# Altium project PiMX8MP_r0.3_release.PrjPcb (part 2 of 6)

## Sheet 06_8MPLUS_IO.SchDoc: 8MPLUS_IO
size 420 x 297 mm; Author: Lukas Henkel; DocumentNumber: 6; SheetNumber: 6; SheetTotal: 16; DocSize: A3
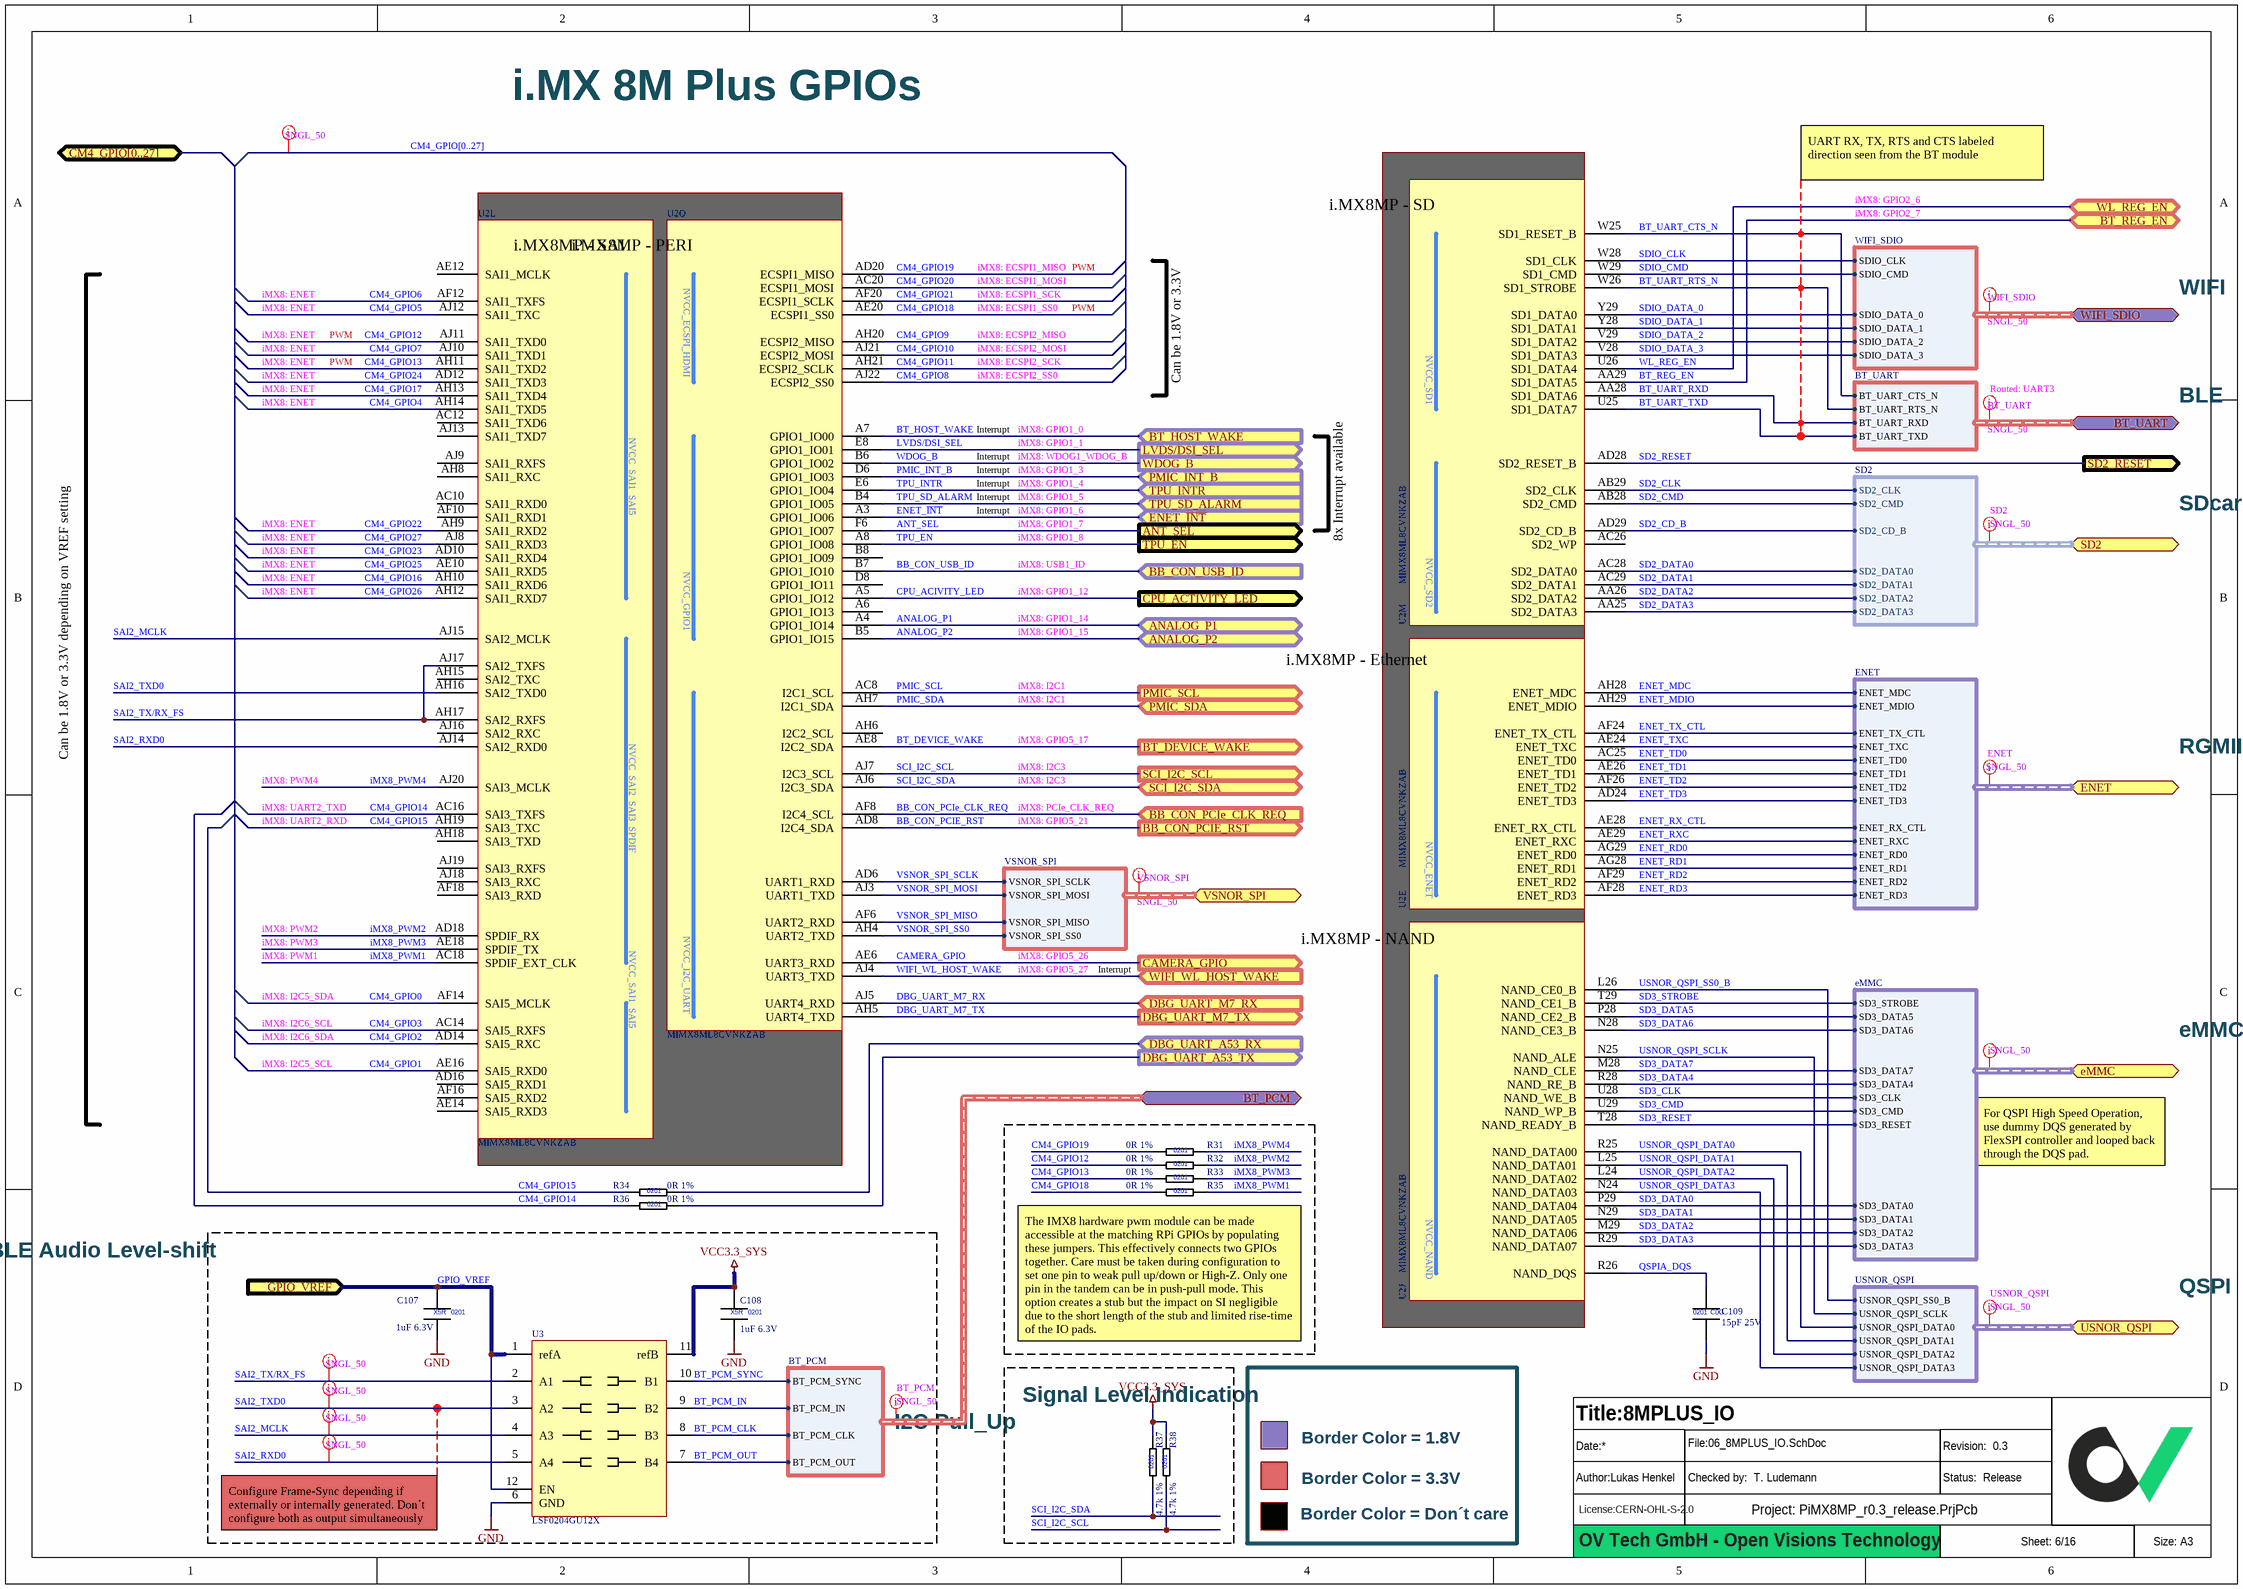
[diagram p6: 06_8MPLUS_IO.SchDoc]

### Parts
(Parts that share a designator on the sheet are numbered #1, #2 ... from top to bottom, then left to right.)
?#6  (no value)  (graphical)
C107  1uF 6.3V  [CAPC0603X03L]
C108  1uF 6.3V  [CAPC0603X03L]
C109  15pF 25V  [CAPC0603X03L]
R31  0R 1%  [RESC0603X03L]
R32  0R 1%  [RESC0603X03L]
R33  0R 1%  [RESC0603X03L]
R34  0R 1%  [RESC0603X03L]
R35  0R 1%  [RESC0603X03L]
R36  0R 1%  [RESC0603X03L]
R37  4.7k 1%  [RESC0603X03L]
R38  4.7k 1%  [RESC0603X03L]
U2  MIMX8ML8CVNKZAB  [BGA548C50P29X29_1500X1500X148]  (parts E,J,L,M,O of 15)
U3  LSF0204GU12X  [QFN40P170X200X50-12L]

### Blocks framed on the sheet
BLE Audio Level-shift: C107 C108 U3
I2C Pull_Up: R37 R38

### Ports
ANALOG_P1 (bidir), ANALOG_P2 (bidir), ANT_SEL (out), BB_CON_PCIe_CLK_REQ (in), BB_CON_PCIE_RST (out), BB_CON_USB_ID (in), BT_DEVICE_WAKE (out), BT_HOST_WAKE (in), BT_PCM (bidir, harness BT_PCM), BT_REG_EN (bidir), BT_UART (bidir, harness BT_UART), CAMERA_GPIO (out), CM4_GPIO[0..27] (bidir), CPU_ACTIVITY_LED (out), DBG_UART_A53_RX (in), DBG_UART_A53_TX (out), DBG_UART_M7_RX (in), DBG_UART_M7_TX (out), eMMC (bidir, harness eMMC), ENET (bidir, harness ENET), ENET_~{INT} (in), GPIO_VREF (in), LVDS/DSI_SEL (out), PMIC_INT_B (in), PMIC_SCL (out), PMIC_SDA (bidir), SCI_I2C_SCL (out), SCI_I2C_SDA (bidir), SD2 (bidir, harness SD2), SD2_RESET (out), TPU_EN (out), TPU_INTR (in), TPU_SD_ALARM (in), USNOR_QSPI (bidir, harness USNOR_QSPI), VSNOR_SPI (bidir, harness VSNOR_SPI), WDOG_B (out), WIFI_SDIO (bidir, harness WIFI_SDIO), WIFI_WL_HOST_WAKE (in), WL_REG_EN (bidir)

### Harnesses
ENET: ENET_MDC, ENET_MDIO, ENET_TX_CTL, ENET_TXC, ENET_TD0, ENET_TD1, ENET_TD2, ENET_TD3, ENET_RX_CTL, ENET_RXC, ENET_RD0, ENET_RD1, ENET_RD2, ENET_RD3
SD2: SD2_CLK, SD2_CMD, SD2_CD_B, SD2_DATA0, SD2_DATA1, SD2_DATA2, SD2_DATA3
WIFI_SDIO: SDIO_DATA_1, SDIO_DATA_0, SDIO_DATA_3, SDIO_DATA_2, SDIO_CMD, SDIO_CLK
BT_UART: BT_UART_TXD, BT_UART_RXD, BT_UART_RTS_N, BT_UART_CTS_N
BT_PCM: BT_PCM_SYNC, BT_PCM_IN, BT_PCM_OUT, BT_PCM_CLK
eMMC: SD3_STROBE, SD3_CLK, SD3_CMD, SD3_DATA0, SD3_DATA1, SD3_DATA2, SD3_DATA3, SD3_DATA4, SD3_DATA5, SD3_DATA6, SD3_DATA7, SD3_RESET
USNOR_QSPI: USNOR_QSPI_SCLK, USNOR_QSPI_SS0_B, USNOR_QSPI_DATA0, USNOR_QSPI_DATA1, USNOR_QSPI_DATA2, USNOR_QSPI_DATA3
VSNOR_SPI: VSNOR_SPI_SS0, VSNOR_SPI_SCLK, VSNOR_SPI_MOSI, VSNOR_SPI_MISO

### Nets
GND: C107.2 C108.2 C109.2 U3.6(GND)
VCC3.3_SYS: C108.1 R37.2 R38.2 U3.11(refB)
ANALOG_P1: U2.A4(GPIO1_IO14) ; port ANALOG_P1
ANALOG_P2: U2.B5(GPIO1_IO15) ; port ANALOG_P2
ANT_SEL: U2.F6(GPIO1_IO07) ; port ANT_SEL
BB_CON_PCIe_CLK_REQ: U2.AF8(I2C4_SCL) ; port BB_CON_PCIe_CLK_REQ
BB_CON_PCIE_RST: U2.AD8(I2C4_SDA) ; port BB_CON_PCIE_RST
BB_CON_USB_ID: U2.B7(GPIO1_IO10) ; port BB_CON_USB_ID
BT_DEVICE_WAKE: U2.AE8(I2C2_SDA) ; port BT_DEVICE_WAKE
BT_HOST_WAKE: U2.A7(GPIO1_IO00) ; port BT_HOST_WAKE
BT_PCM_CLK: U3.8(B3) ; port BT_PCM.BT_PCM_CLK
BT_PCM_IN: U3.9(B2) ; port BT_PCM.BT_PCM_IN
BT_PCM_OUT: U3.7(B4) ; port BT_PCM.BT_PCM_OUT
BT_PCM_SYNC: U3.10(B1) ; port BT_PCM.BT_PCM_SYNC
BT_REG_EN: U2.AA29(SD1_DATA5) ; port BT_REG_EN
BT_UART_CTS_N: U2.W25(SD1_RESET_B) ; port BT_UART.BT_UART_CTS_N
BT_UART_RTS_N: U2.W26(SD1_STROBE) ; port BT_UART.BT_UART_RTS_N
BT_UART_RXD: U2.AA28(SD1_DATA6) ; port BT_UART.BT_UART_RXD
BT_UART_TXD: U2.U25(SD1_DATA7) ; port BT_UART.BT_UART_TXD
CAMERA_GPIO: U2.AE6(UART3_RXD) ; port CAMERA_GPIO
CM4_GPIO0: U2.AF14(SAI5_MCLK)
CM4_GPIO1: U2.AE16(SAI5_RXD0)
CM4_GPIO2: U2.AD14(SAI5_RXC)
CM4_GPIO3: U2.AC14(SAI5_RXFS)
CM4_GPIO4: U2.AH14(SAI1_TXD5)
CM4_GPIO5: U2.AJ12(SAI1_TXC)
CM4_GPIO6: U2.AF12(SAI1_TXFS)
CM4_GPIO7: U2.AJ10(SAI1_TXD1)
CM4_GPIO8: U2.AJ22(ECSPI2_SS0)
CM4_GPIO9: U2.AH20(ECSPI2_MISO)
CM4_GPIO10: U2.AJ21(ECSPI2_MOSI)
CM4_GPIO11: U2.AH21(ECSPI2_SCLK)
CM4_GPIO12: R32.1 U2.AJ11(SAI1_TXD0)
CM4_GPIO13: R33.1 U2.AH11(SAI1_TXD2)
CM4_GPIO14: R36.1 U2.AC16(SAI3_TXFS)
CM4_GPIO15: R34.1 U2.AH19(SAI3_TXC)
CM4_GPIO16: U2.AH10(SAI1_RXD6)
CM4_GPIO17: U2.AH13(SAI1_TXD4)
CM4_GPIO18: R35.1 U2.AE20(ECSPI1_SS0)
CM4_GPIO19: R31.1 U2.AD20(ECSPI1_MISO)
CM4_GPIO20: U2.AC20(ECSPI1_MOSI)
CM4_GPIO21: U2.AF20(ECSPI1_SCLK)
CM4_GPIO22: U2.AH9(SAI1_RXD2)
CM4_GPIO23: U2.AD10(SAI1_RXD4)
CM4_GPIO24: U2.AD12(SAI1_TXD3)
CM4_GPIO25: U2.AE10(SAI1_RXD5)
CM4_GPIO26: U2.AH12(SAI1_RXD7)
CM4_GPIO27: U2.AJ8(SAI1_RXD3)
CPU_ACIVITY_LED: U2.A5(GPIO1_IO12) ; port CPU_ACTIVITY_LED
DBG_UART_A53_RX: R34.2 ; port DBG_UART_A53_RX
DBG_UART_A53_TX: R36.2 ; port DBG_UART_A53_TX
DBG_UART_M7_RX: U2.AJ5(UART4_RXD) ; port DBG_UART_M7_RX
DBG_UART_M7_TX: U2.AH5(UART4_TXD) ; port DBG_UART_M7_TX
ENET_~{INT}: U2.A3(GPIO1_IO06) ; port ENET_~{INT}
ENET_MDC: U2.AH28(ENET_MDC) ; port ENET.ENET_MDC
ENET_MDIO: U2.AH29(ENET_MDIO) ; port ENET.ENET_MDIO
ENET_RD0: U2.AG29(ENET_RD0) ; port ENET.ENET_RD0
ENET_RD1: U2.AG28(ENET_RD1) ; port ENET.ENET_RD1
ENET_RD2: U2.AF29(ENET_RD2) ; port ENET.ENET_RD2
ENET_RD3: U2.AF28(ENET_RD3) ; port ENET.ENET_RD3
ENET_RX_CTL: U2.AE28(ENET_RX_CTL) ; port ENET.ENET_RX_CTL
ENET_RXC: U2.AE29(ENET_RXC) ; port ENET.ENET_RXC
ENET_TD0: U2.AC25(ENET_TD0) ; port ENET.ENET_TD0
ENET_TD1: U2.AE26(ENET_TD1) ; port ENET.ENET_TD1
ENET_TD2: U2.AF26(ENET_TD2) ; port ENET.ENET_TD2
ENET_TD3: U2.AD24(ENET_TD3) ; port ENET.ENET_TD3
ENET_TX_CTL: U2.AF24(ENET_TX_CTL) ; port ENET.ENET_TX_CTL
ENET_TXC: U2.AE24(ENET_TXC) ; port ENET.ENET_TXC
GPIO_VREF: C107.1 U3.1(refA) U3.12(EN) ; port GPIO_VREF
iMX8_PWM1: R35.2 U2.AC18(SPDIF_EXT_CLK)
iMX8_PWM2: R32.2 U2.AD18(SPDIF_RX)
iMX8_PWM3: R33.2 U2.AE18(SPDIF_TX)
iMX8_PWM4: R31.2 U2.AJ20(SAI3_MCLK)
LVDS/DSI_SEL: U2.E8(GPIO1_IO01) ; port LVDS/DSI_SEL
PMIC_INT_B: U2.D6(GPIO1_IO03) ; port PMIC_INT_B
PMIC_SCL: U2.AC8(I2C1_SCL) ; port PMIC_SCL
PMIC_SDA: U2.AH7(I2C1_SDA) ; port PMIC_SDA
QSPIA_DQS: C109.1 U2.R26(NAND_DQS)
SAI2_MCLK: U2.AJ15(SAI2_MCLK) U3.4(A3)
SAI2_RXD0: U2.AJ14(SAI2_RXD0) U3.5(A4)
SAI2_TX/RX_FS: U2.AH17(SAI2_RXFS) U2.AJ17(SAI2_TXFS) U3.2(A1)
SAI2_TXD0: U2.AH16(SAI2_TXD0) U3.3(A2)
SCI_I2C_SCL: R38.1 U2.AJ7(I2C3_SCL) ; port SCI_I2C_SCL
SCI_I2C_SDA: R37.1 U2.AJ6(I2C3_SDA) ; port SCI_I2C_SDA
SD2_CD_B: U2.AD29(SD2_CD_B) ; port SD2.SD2_CD_B
SD2_CLK: U2.AB29(SD2_CLK) ; port SD2.SD2_CLK
SD2_CMD: U2.AB28(SD2_CMD) ; port SD2.SD2_CMD
SD2_DATA0: U2.AC28(SD2_DATA0) ; port SD2.SD2_DATA0
SD2_DATA1: U2.AC29(SD2_DATA1) ; port SD2.SD2_DATA1
SD2_DATA2: U2.AA26(SD2_DATA2) ; port SD2.SD2_DATA2
SD2_DATA3: U2.AA25(SD2_DATA3) ; port SD2.SD2_DATA3
SD2_RESET: U2.AD28(SD2_RESET_B) ; port SD2_RESET
SD3_CLK: U2.U28(NAND_WE_B) ; port eMMC.SD3_CLK
SD3_CMD: U2.U29(NAND_WP_B) ; port eMMC.SD3_CMD
SD3_DATA0: U2.P29(NAND_DATA04) ; port eMMC.SD3_DATA0
SD3_DATA1: U2.N29(NAND_DATA05) ; port eMMC.SD3_DATA1
SD3_DATA2: U2.M29(NAND_DATA06) ; port eMMC.SD3_DATA2
SD3_DATA3: U2.R29(NAND_DATA07) ; port eMMC.SD3_DATA3
SD3_DATA4: U2.R28(NAND_RE_B) ; port eMMC.SD3_DATA4
SD3_DATA5: U2.P28(NAND_CE2_B) ; port eMMC.SD3_DATA5
SD3_DATA6: U2.N28(NAND_CE3_B) ; port eMMC.SD3_DATA6
SD3_DATA7: U2.M28(NAND_CLE) ; port eMMC.SD3_DATA7
SD3_RESET: U2.T28(NAND_READY_B) ; port eMMC.SD3_RESET
SD3_STROBE: U2.T29(NAND_CE1_B) ; port eMMC.SD3_STROBE
SDIO_CLK: U2.W28(SD1_CLK) ; port WIFI_SDIO.SDIO_CLK
SDIO_CMD: U2.W29(SD1_CMD) ; port WIFI_SDIO.SDIO_CMD
SDIO_DATA_0: U2.Y29(SD1_DATA0) ; port WIFI_SDIO.SDIO_DATA_0
SDIO_DATA_1: U2.Y28(SD1_DATA1) ; port WIFI_SDIO.SDIO_DATA_1
SDIO_DATA_2: U2.V29(SD1_DATA2) ; port WIFI_SDIO.SDIO_DATA_2
SDIO_DATA_3: U2.V28(SD1_DATA3) ; port WIFI_SDIO.SDIO_DATA_3
TPU_EN: U2.A8(GPIO1_IO08) ; port TPU_EN
TPU_INTR: U2.E6(GPIO1_IO04) ; port TPU_INTR
TPU_SD_ALARM: U2.B4(GPIO1_IO05) ; port TPU_SD_ALARM
USNOR_QSPI_DATA0: U2.R25(NAND_DATA00) ; port USNOR_QSPI.USNOR_QSPI_DATA0
USNOR_QSPI_DATA1: U2.L25(NAND_DATA01) ; port USNOR_QSPI.USNOR_QSPI_DATA1
USNOR_QSPI_DATA2: U2.L24(NAND_DATA02) ; port USNOR_QSPI.USNOR_QSPI_DATA2
USNOR_QSPI_DATA3: U2.N24(NAND_DATA03) ; port USNOR_QSPI.USNOR_QSPI_DATA3
USNOR_QSPI_SCLK: U2.N25(NAND_ALE) ; port USNOR_QSPI.USNOR_QSPI_SCLK
USNOR_QSPI_SS0_B: U2.L26(NAND_CE0_B) ; port USNOR_QSPI.USNOR_QSPI_SS0_B
VSNOR_SPI_MISO: U2.AF6(UART2_RXD) ; port VSNOR_SPI.VSNOR_SPI_MISO
VSNOR_SPI_MOSI: U2.AJ3(UART1_TXD) ; port VSNOR_SPI.VSNOR_SPI_MOSI
VSNOR_SPI_SCLK: U2.AD6(UART1_RXD) ; port VSNOR_SPI.VSNOR_SPI_SCLK
VSNOR_SPI_SS0: U2.AH4(UART2_TXD) ; port VSNOR_SPI.VSNOR_SPI_SS0
WDOG_B: U2.B6(GPIO1_IO02) ; port WDOG_B
WIFI_WL_HOST_WAKE: U2.AJ4(UART3_TXD) ; port WIFI_WL_HOST_WAKE
WL_REG_EN: U2.U26(SD1_DATA4) ; port WL_REG_EN

Not connected (* = marked no-connect by the designer): U2 A6(GPIO1_IO13) AC10(SAI1_RXD0) AC12(SAI1_TXD6) AC26(SD2_WP) AD16(SAI5_RXD1) AE12(SAI1_MCLK) AE14(SAI5_RXD3) AF10(SAI1_RXD1) AF16(SAI5_RXD2) AF18(SAI3_RXD) AH6(I2C2_SCL) AH8(SAI1_RXC) AH15(SAI2_TXC) AH18(SAI3_TXD) AJ9(SAI1_RXFS) AJ13(SAI1_TXD7) AJ16(SAI2_RXC) AJ18(SAI3_RXC) AJ19(SAI3_RXFS) B8(GPIO1_IO09) D8(GPIO1_IO11)

### Buses and harness runs
bus CM4_GPIO[0..27] = port CM4_GPIO[0..27]

### Layout directives
net class ENET; net class SNGL_50: (no net found under the mark)
net class SD2; net class SNGL_50: (no net found under the mark)
net class WIFI_SDIO; net class SNGL_50: (no net found under the mark)
net class BT_UART; net class SNGL_50: (no net found under the mark)
net class BT_PCM; net class SNGL_50: (no net found under the mark)
net class SNGL_50: (no net found under the mark), SAI2_MCLK, SAI2_RXD0, SAI2_TX/RX_FS, SAI2_TXD0
net class USNOR_QSPI; net class SNGL_50: (no net found under the mark)
net class VSNOR_SPI; net class SNGL_50: (no net found under the mark)

### Notes on the sheet
- i.MX 8M Plus GPIOs
- UART RX, TX, RTS and CTS labeled direction seen from the BT module
- iMX8: GPIO2_7
- iMX8: GPIO2_6
- iMX8: ENET
- iMX8: ECSPI1_MISO
- iMX8: ECSPI1_MOSI
- iMX8: ECSPI1_SCK
- iMX8: ECSPI1_SS0
- PWM
- WIFI
- iMX8: ECSPI2_MISO
- iMX8: ECSPI2_MOSI
- iMX8: ECSPI2_SCK
- iMX8: ECSPI2_SS0
- Can be 1.8V or 3.3V
- Routed: UART3
- Interrupt
- iMX8: WDOG1_WDOG_B
- iMX8: GPIO1_1
- iMX8: GPIO1_0
- BLE
- iMX8: GPIO1_3
- iMX8: GPIO1_4
- iMX8: GPIO1_5
- iMX8: GPIO1_6
- iMX8: GPIO1_7
- SDcard external
- iMX8: USB1_ID
- iMX8: GPIO1_12
- iMX8: GPIO1_8
- 8x Interrupt available
- iMX8: GPIO1_14
- iMX8: GPIO1_15
- iMX8: I2C1
- Can be 1.8V or 3.3V depending on VREF setting
- iMX8: PWM4
- iMX8: GPIO5_17
- iMX8: I2C3
- RGMII
- iMX8: UART2_RXD
- iMX8: UART2_TXD
- iMX8: GPIO5_21
- iMX8: PCIe_CLK_REQ
- iMX8: PWM2
- Routed: ECSPI3
- iMX8: I2C5_SDA
- iMX8: PWM1
- iMX8: PWM3
- iMX8: GPIO5_26
- iMX8: GPIO5_27
- iMX8: I2C5_SCL
- iMX8: I2C6_SCL
- iMX8: I2C6_SDA
- eMMC
- For QSPI High Speed Operation, use dummy DQS generated by FlexSPI controller and looped back through the DQS pad.
- (near R35) The IMX8 hardware pwm module can be made accessible at the matching RPi GPIOs by populating these jumpers. This effectively connects two GPIOs together. Care must be taken during configuration to set one pin to weak pull up/down or High-Z. Only one pin in the tandem can be in push-pull mode. This option creates a stub but the impact on SI negligible due to the short length of the stub and limited rise-time of the IO pads.
- QSPI
- Signal Level Indication
- Border Color = 1.8V
- Configure Frame-Sync depending if externally or internally generated. Don´t configure both as output simultaneously
- Border Color = Don´t care
- Border Color = 3.3V
- OV Tech GmbH - Open Visions Technology
- (in symbol CAP_0201_1uF_6.3V) X5R; 0201
- (in symbol CAP_0201_15pF_25V) 0201; C0G
- (in symbol RES_0201_0R_1%) 0201
- (in symbol RES_0201_4.7k_1%) 0201
- (in symbol SoC_i.MX 8M Plus_Quad, part E) i.MX8MP - Ethernet
- (in symbol SoC_i.MX 8M Plus_Quad, part J) i.MX8MP - NAND
- (in symbol SoC_i.MX 8M Plus_Quad, part L) i.MX8MP - SAI
- (in symbol SoC_i.MX 8M Plus_Quad, part M) i.MX8MP - SD
- (in symbol SoC_i.MX 8M Plus_Quad, part O) i.MX8MP - PERI; NVCC_GPIO1

### Library data of the parts
?#6 = Titleblock_01_OpenSource
C107 C108 = CAP_0201_1uF_6.3V: Multilayer Ceramic Capacitors MLCC - SMD/SMT 0201 6.3VDC; Manufacturer 1: Murata Electronics; Manufacturer 1 Prt. Nr.: GRM033R60J105MEA2D; Manufacturer 2 Prt. Nr.: CL03A105MQ3CSNC; Manufacturer 2: Samsung Electro-Mechanics
C109 = CAP_0201_15pF_25V: Multilayer Ceramic Capacitors MLCC - SMD/SMT 0201 25VDC; Manufacturer 1: Murata Electronics; Manufacturer 1 Prt. Nr.: GCM0335C1E150FA16J; Manufacturer 2 Prt. Nr.: C0201C150J3GACTU; Manufacturer 2: KEMET
R31-R36 = RES_0201_0R_1%: Thick Film Resistors - SMD 0R OHM 1%; Manufacturer 1: Yageo; Manufacturer 1 Prt. Nr.: RC0201FR-070RL; Manufacturer 2 Prt. Nr.: CRCW02010000Z0ED; Manufacturer 2: Vishay / Dale
R37 R38 = RES_0201_4.7k_1%: Thick Film Resistors - SMD 4.7K OHM 1%; Manufacturer 1: Yageo; Manufacturer 1 Prt. Nr.: RC0201JR-074K7P; Manufacturer 2 Prt. Nr.: CRCW02014K70FNED; Manufacturer 2: Vishay / Dale
U2 = SoC_i.MX 8M Plus_Quad: i.MX 8M Plus Applications Processor  for Industrial Products; Manufacturer 1: NXP Semiconductor; Manufacturer 1 Prt. Nr.: MIMX8ML8CVNKZAB
U3 = Quad_Bidirectional_LvL Shift_LSF0204GU12X: 4-bit bidirectional multi-voltage level translator; Manufacturer 1: Nexperia; Manufacturer 1 Prt. Nr.: LSF0204GU12X; Temperature Range: -40°C - 125°C

## Sheet 07_8MPLUS_PHY.SchDoc: 8MPLUS_PHY
size 420 x 297 mm; Author: Lukas Henkel; DocumentNumber: 7; SheetNumber: 7; SheetTotal: 16; DocSize: A3
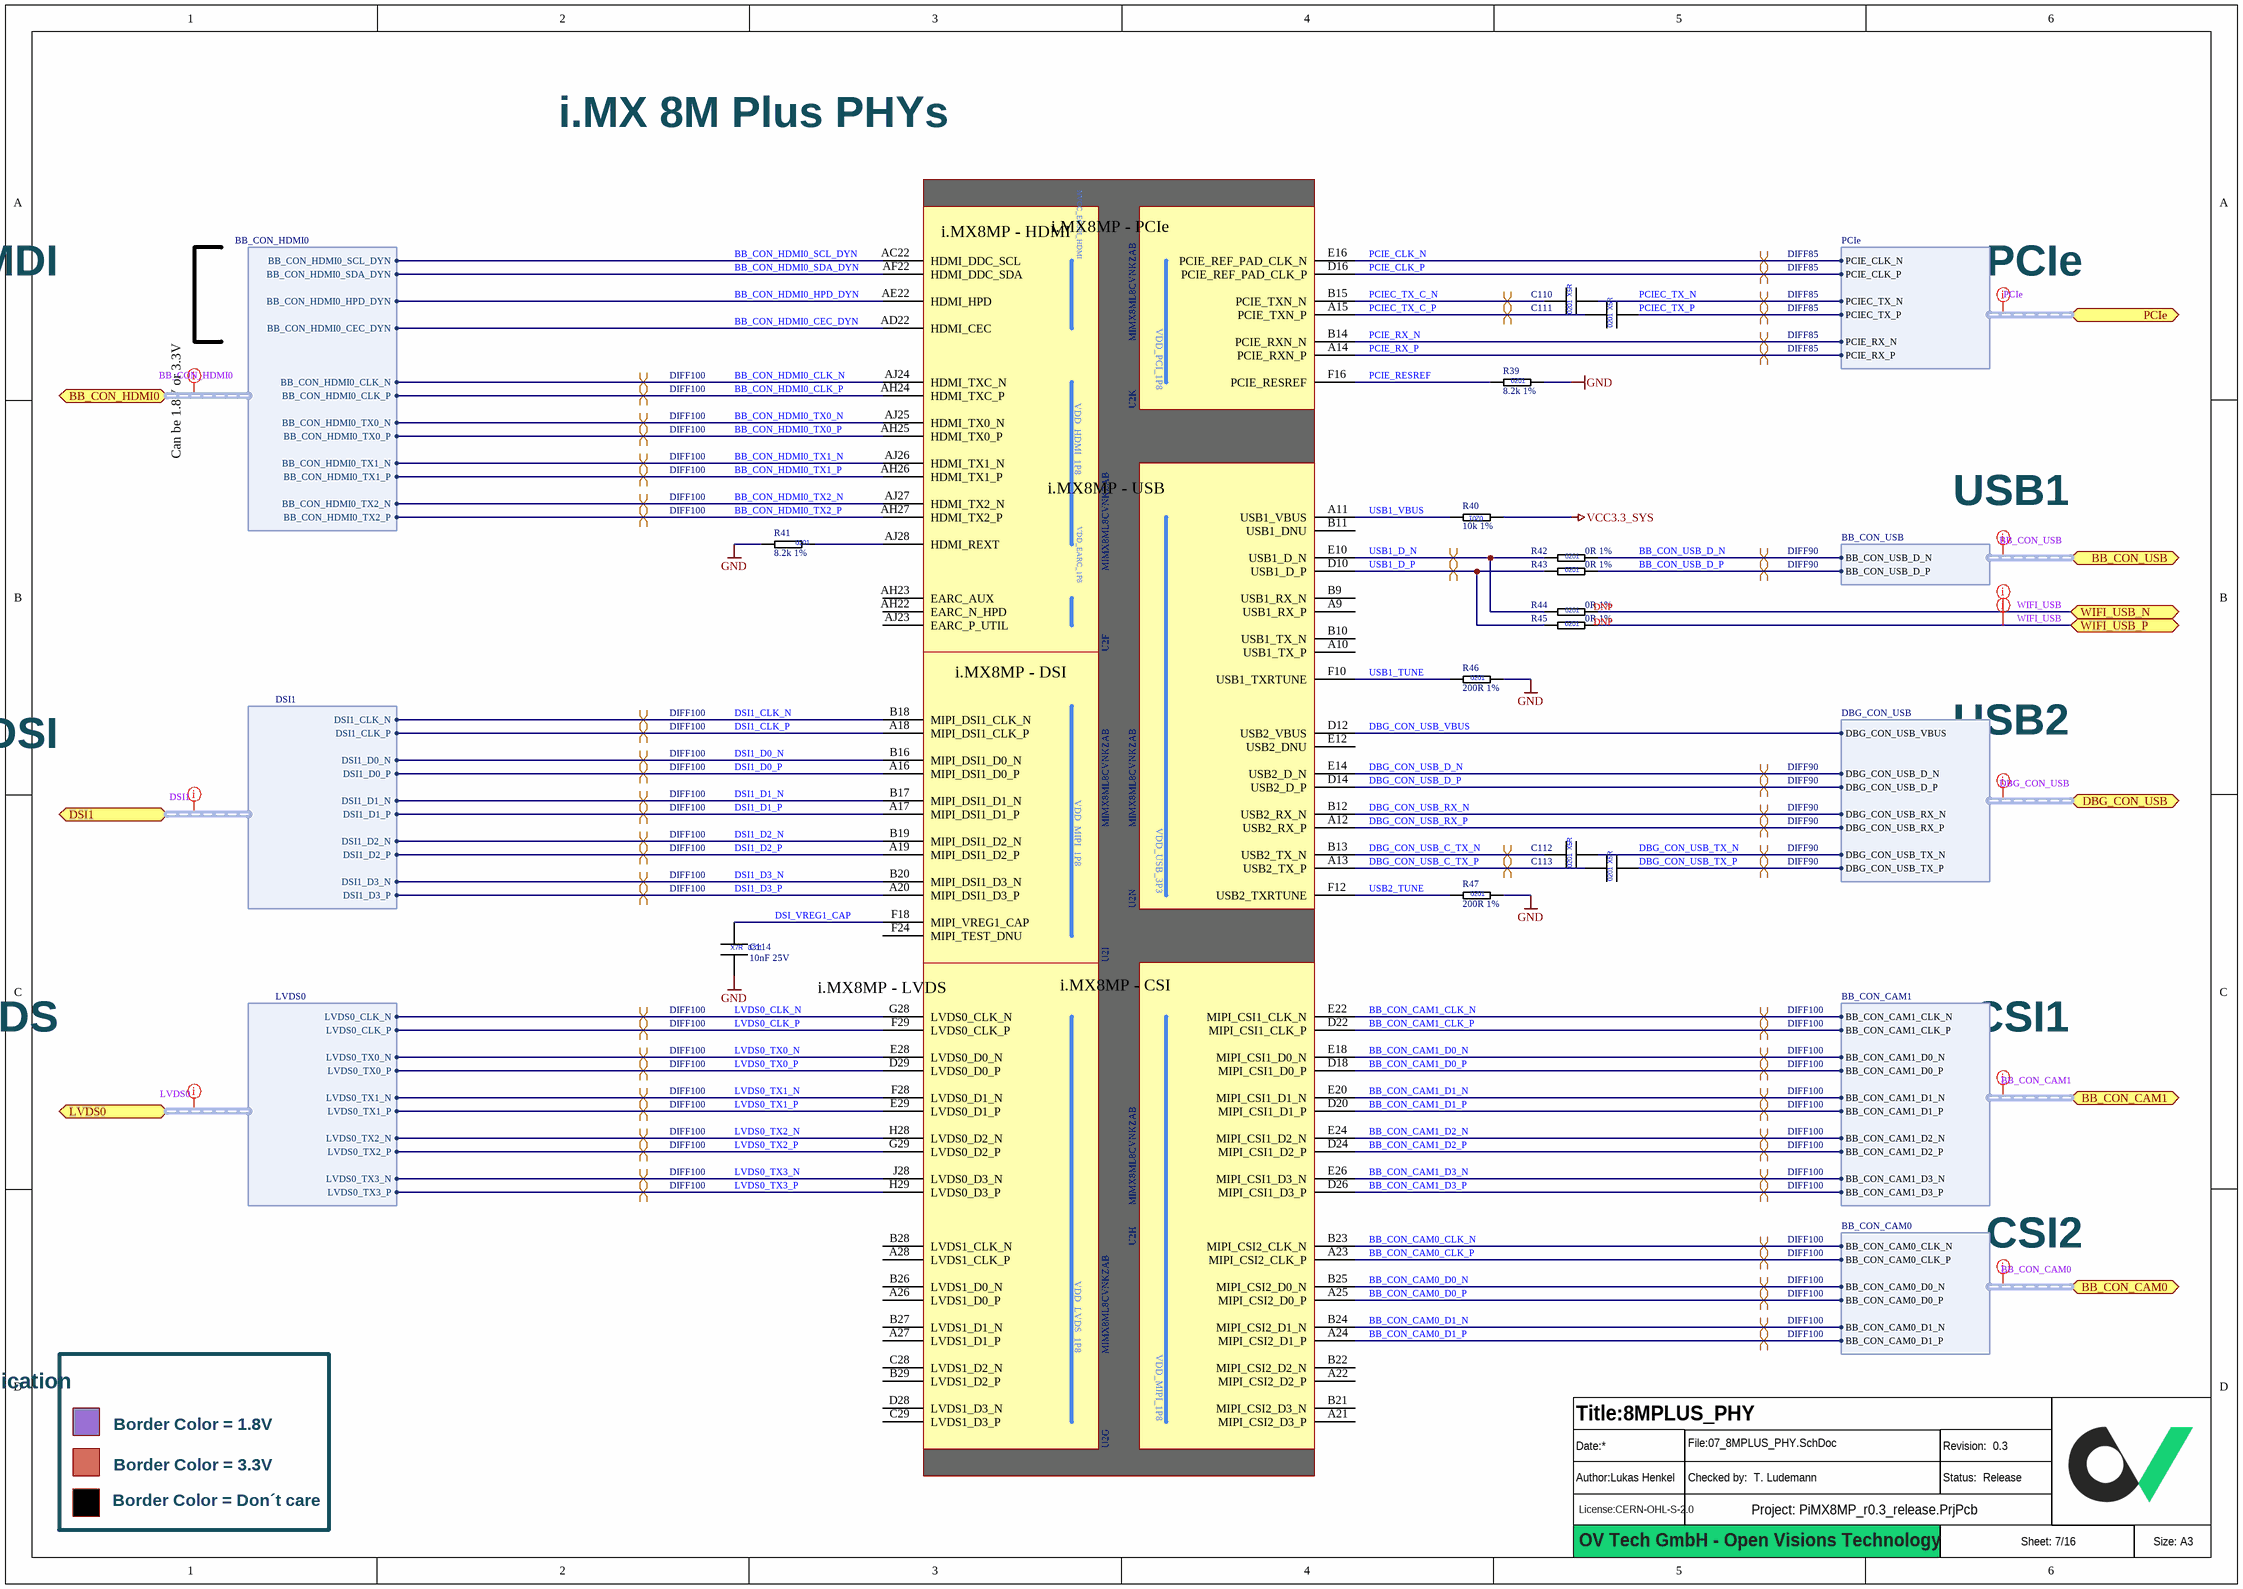
[diagram p7: 07_8MPLUS_PHY.SchDoc]

### Parts
(Parts that share a designator on the sheet are numbered #1, #2 ... from top to bottom, then left to right.)
?#7  (no value)  (graphical)
C110  100nF 10V  [CAPC0603X03L]  (value not drawn)
C111  100nF 10V  [CAPC0603X03L]  (value not drawn)
C112  100nF 10V  [CAPC0603X03L]  (value not drawn)
C113  100nF 10V  [CAPC0603X03L]  (value not drawn)
C114  10nF 25V  [CAPC0603X03L]
R39  8.2k 1%  [RESC0603X03L]
R40  10k 1%  [RESC0603X03L]
R41  8.2k 1%  [RESC0603X03L]
R42  0R 1%  [RESC0603X03L]
R43  0R 1%  [RESC0603X03L]
R44  0R 1%  [RESC0603X03L]
R45  0R 1%  [RESC0603X03L]
R46  200R 1%  [RESC0603X03L]
R47  200R 1%  [RESC0603X03L]
U2  MIMX8ML8CVNKZAB  [BGA548C50P29X29_1500X1500X148]  (parts F,G,H,I,K,N of 15)

### Ports
BB_CON_CAM0 (bidir, harness BB_CON_CAM0), BB_CON_CAM1 (bidir, harness BB_CON_CAM1), BB_CON_HDMI0 (bidir, harness BB_CON_HDMI0), BB_CON_USB (bidir, harness BB_CON_USB), DBG_CON_USB (bidir, harness DBG_CON_USB), DSI1 (bidir, harness DSI1), LVDS0 (bidir, harness LVDS0), PCIe (bidir, harness PCIe), WIFI_USB_N (bidir), WIFI_USB_P (bidir)

### Harnesses
BB_CON_HDMI0: BB_CON_HDMI0_SCL_DYN, BB_CON_HDMI0_SDA_DYN, BB_CON_HDMI0_HPD_DYN, BB_CON_HDMI0_CEC_DYN, BB_CON_HDMI0_CLK_N, BB_CON_HDMI0_CLK_P, BB_CON_HDMI0_TX0_N, BB_CON_HDMI0_TX0_P, BB_CON_HDMI0_TX1_N, BB_CON_HDMI0_TX1_P, BB_CON_HDMI0_TX2_N, BB_CON_HDMI0_TX2_P
BB_CON_USB: BB_CON_USB_D_N, BB_CON_USB_D_P
PCIe: PCIE_CLK_N, PCIE_CLK_P, PCIEC_TX_N, PCIE_RX_P, PCIE_RX_N, PCIEC_TX_P
BB_CON_CAM1: BB_CON_CAM1_D0_N, BB_CON_CAM1_D0_P, BB_CON_CAM1_D1_N, BB_CON_CAM1_D1_P, BB_CON_CAM1_CLK_N, BB_CON_CAM1_CLK_P, BB_CON_CAM1_D2_N, BB_CON_CAM1_D2_P, BB_CON_CAM1_D3_N, BB_CON_CAM1_D3_P
BB_CON_CAM0: BB_CON_CAM0_D0_N, BB_CON_CAM0_D0_P, BB_CON_CAM0_D1_N, BB_CON_CAM0_D1_P, BB_CON_CAM0_CLK_N, BB_CON_CAM0_CLK_P
DSI1: DSI1_CLK_N, DSI1_CLK_P, DSI1_D0_N, DSI1_D0_P, DSI1_D1_N, DSI1_D1_P, DSI1_D2_N, DSI1_D2_P, DSI1_D3_N, DSI1_D3_P
LVDS0: LVDS0_CLK_N, LVDS0_CLK_P, LVDS0_TX0_N, LVDS0_TX0_P, LVDS0_TX1_N, LVDS0_TX1_P, LVDS0_TX2_N, LVDS0_TX2_P, LVDS0_TX3_N, LVDS0_TX3_P
DBG_CON_USB: DBG_CON_USB_VBUS, DBG_CON_USB_D_N, DBG_CON_USB_D_P, DBG_CON_USB_RX_N, DBG_CON_USB_RX_P, DBG_CON_USB_TX_N, DBG_CON_USB_TX_P

### Nets
GND: C114.2 R39.2 R41.2 R46.2 R47.2
VCC3.3_SYS: R40.1
BB_CON_CAM0_CLK_N: U2.B23(MIPI_CSI2_CLK_N) ; port BB_CON_CAM0.BB_CON_CAM0_CLK_N
BB_CON_CAM0_CLK_P: U2.A23(MIPI_CSI2_CLK_P) ; port BB_CON_CAM0.BB_CON_CAM0_CLK_P
BB_CON_CAM0_D0_N: U2.B25(MIPI_CSI2_D0_N) ; port BB_CON_CAM0.BB_CON_CAM0_D0_N
BB_CON_CAM0_D0_P: U2.A25(MIPI_CSI2_D0_P) ; port BB_CON_CAM0.BB_CON_CAM0_D0_P
BB_CON_CAM0_D1_N: U2.B24(MIPI_CSI2_D1_N) ; port BB_CON_CAM0.BB_CON_CAM0_D1_N
BB_CON_CAM0_D1_P: U2.A24(MIPI_CSI2_D1_P) ; port BB_CON_CAM0.BB_CON_CAM0_D1_P
BB_CON_CAM1_CLK_N: U2.E22(MIPI_CSI1_CLK_N) ; port BB_CON_CAM1.BB_CON_CAM1_CLK_N
BB_CON_CAM1_CLK_P: U2.D22(MIPI_CSI1_CLK_P) ; port BB_CON_CAM1.BB_CON_CAM1_CLK_P
BB_CON_CAM1_D0_N: U2.E18(MIPI_CSI1_D0_N) ; port BB_CON_CAM1.BB_CON_CAM1_D0_N
BB_CON_CAM1_D0_P: U2.D18(MIPI_CSI1_D0_P) ; port BB_CON_CAM1.BB_CON_CAM1_D0_P
BB_CON_CAM1_D1_N: U2.E20(MIPI_CSI1_D1_N) ; port BB_CON_CAM1.BB_CON_CAM1_D1_N
BB_CON_CAM1_D1_P: U2.D20(MIPI_CSI1_D1_P) ; port BB_CON_CAM1.BB_CON_CAM1_D1_P
BB_CON_CAM1_D2_N: U2.E24(MIPI_CSI1_D2_N) ; port BB_CON_CAM1.BB_CON_CAM1_D2_N
BB_CON_CAM1_D2_P: U2.D24(MIPI_CSI1_D2_P) ; port BB_CON_CAM1.BB_CON_CAM1_D2_P
BB_CON_CAM1_D3_N: U2.E26(MIPI_CSI1_D3_N) ; port BB_CON_CAM1.BB_CON_CAM1_D3_N
BB_CON_CAM1_D3_P: U2.D26(MIPI_CSI1_D3_P) ; port BB_CON_CAM1.BB_CON_CAM1_D3_P
BB_CON_HDMI0_CEC_DYN: U2.AD22(HDMI_CEC) ; port BB_CON_HDMI0.BB_CON_HDMI0_CEC_DYN
BB_CON_HDMI0_CLK_N: U2.AJ24(HDMI_TXC_N) ; port BB_CON_HDMI0.BB_CON_HDMI0_CLK_N
BB_CON_HDMI0_CLK_P: U2.AH24(HDMI_TXC_P) ; port BB_CON_HDMI0.BB_CON_HDMI0_CLK_P
BB_CON_HDMI0_HPD_DYN: U2.AE22(HDMI_HPD) ; port BB_CON_HDMI0.BB_CON_HDMI0_HPD_DYN
BB_CON_HDMI0_SCL_DYN: U2.AC22(HDMI_DDC_SCL) ; port BB_CON_HDMI0.BB_CON_HDMI0_SCL_DYN
BB_CON_HDMI0_SDA_DYN: U2.AF22(HDMI_DDC_SDA) ; port BB_CON_HDMI0.BB_CON_HDMI0_SDA_DYN
BB_CON_HDMI0_TX0_N: U2.AJ25(HDMI_TX0_N) ; port BB_CON_HDMI0.BB_CON_HDMI0_TX0_N
BB_CON_HDMI0_TX0_P: U2.AH25(HDMI_TX0_P) ; port BB_CON_HDMI0.BB_CON_HDMI0_TX0_P
BB_CON_HDMI0_TX1_N: U2.AJ26(HDMI_TX1_N) ; port BB_CON_HDMI0.BB_CON_HDMI0_TX1_N
BB_CON_HDMI0_TX1_P: U2.AH26(HDMI_TX1_P) ; port BB_CON_HDMI0.BB_CON_HDMI0_TX1_P
BB_CON_HDMI0_TX2_N: U2.AJ27(HDMI_TX2_N) ; port BB_CON_HDMI0.BB_CON_HDMI0_TX2_N
BB_CON_HDMI0_TX2_P: U2.AH27(HDMI_TX2_P) ; port BB_CON_HDMI0.BB_CON_HDMI0_TX2_P
BB_CON_USB_D_N: R42.2 ; port BB_CON_USB.BB_CON_USB_D_N
BB_CON_USB_D_P: R43.2 ; port BB_CON_USB.BB_CON_USB_D_P
DBG_CON_USB_C_TX_N: C112.1 U2.B13(USB2_TX_N)
DBG_CON_USB_C_TX_P: C113.1 U2.A13(USB2_TX_P)
DBG_CON_USB_D_N: U2.E14(USB2_D_N) ; port DBG_CON_USB.DBG_CON_USB_D_N
DBG_CON_USB_D_P: U2.D14(USB2_D_P) ; port DBG_CON_USB.DBG_CON_USB_D_P
DBG_CON_USB_RX_N: U2.B12(USB2_RX_N) ; port DBG_CON_USB.DBG_CON_USB_RX_N
DBG_CON_USB_RX_P: U2.A12(USB2_RX_P) ; port DBG_CON_USB.DBG_CON_USB_RX_P
DBG_CON_USB_TX_N: C112.2 ; port DBG_CON_USB.DBG_CON_USB_TX_N
DBG_CON_USB_TX_P: C113.2 ; port DBG_CON_USB.DBG_CON_USB_TX_P
DBG_CON_USB_VBUS: U2.D12(USB2_VBUS) ; port DBG_CON_USB.DBG_CON_USB_VBUS
DSI1_CLK_N: U2.B18(MIPI_DSI1_CLK_N) ; port DSI1.DSI1_CLK_N
DSI1_CLK_P: U2.A18(MIPI_DSI1_CLK_P) ; port DSI1.DSI1_CLK_P
DSI1_D0_N: U2.B16(MIPI_DSI1_D0_N) ; port DSI1.DSI1_D0_N
DSI1_D0_P: U2.A16(MIPI_DSI1_D0_P) ; port DSI1.DSI1_D0_P
DSI1_D1_N: U2.B17(MIPI_DSI1_D1_N) ; port DSI1.DSI1_D1_N
DSI1_D1_P: U2.A17(MIPI_DSI1_D1_P) ; port DSI1.DSI1_D1_P
DSI1_D2_N: U2.B19(MIPI_DSI1_D2_N) ; port DSI1.DSI1_D2_N
DSI1_D2_P: U2.A19(MIPI_DSI1_D2_P) ; port DSI1.DSI1_D2_P
DSI1_D3_N: U2.B20(MIPI_DSI1_D3_N) ; port DSI1.DSI1_D3_N
DSI1_D3_P: U2.A20(MIPI_DSI1_D3_P) ; port DSI1.DSI1_D3_P
DSI_VREG1_CAP: C114.1 U2.F18(MIPI_VREG1_CAP)
LVDS0_CLK_N: U2.G28(LVDS0_CLK_N) ; port LVDS0.LVDS0_CLK_N
LVDS0_CLK_P: U2.F29(LVDS0_CLK_P) ; port LVDS0.LVDS0_CLK_P
LVDS0_TX0_N: U2.E28(LVDS0_D0_N) ; port LVDS0.LVDS0_TX0_N
LVDS0_TX0_P: U2.D29(LVDS0_D0_P) ; port LVDS0.LVDS0_TX0_P
LVDS0_TX1_N: U2.F28(LVDS0_D1_N) ; port LVDS0.LVDS0_TX1_N
LVDS0_TX1_P: U2.E29(LVDS0_D1_P) ; port LVDS0.LVDS0_TX1_P
LVDS0_TX2_N: U2.H28(LVDS0_D2_N) ; port LVDS0.LVDS0_TX2_N
LVDS0_TX2_P: U2.G29(LVDS0_D2_P) ; port LVDS0.LVDS0_TX2_P
LVDS0_TX3_N: U2.J28(LVDS0_D3_N) ; port LVDS0.LVDS0_TX3_N
LVDS0_TX3_P: U2.H29(LVDS0_D3_P) ; port LVDS0.LVDS0_TX3_P
PCIE_CLK_N: U2.E16(PCIE_REF_PAD_CLK_N) ; port PCIe.PCIE_CLK_N
PCIE_CLK_P: U2.D16(PCIE_REF_PAD_CLK_P) ; port PCIe.PCIE_CLK_P
PCIE_RESREF: R39.1 U2.F16(PCIE_RESREF)
PCIE_RX_N: U2.B14(PCIE_RXN_N) ; port PCIe.PCIE_RX_N
PCIE_RX_P: U2.A14(PCIE_RXN_P) ; port PCIe.PCIE_RX_P
PCIEC_TX_C_N: C110.1 U2.B15(PCIE_TXN_N)
PCIEC_TX_C_P: C111.1 U2.A15(PCIE_TXN_P)
PCIEC_TX_N: C110.2 ; port PCIe.PCIEC_TX_N
PCIEC_TX_P: C111.2 ; port PCIe.PCIEC_TX_P
USB1_D_N: R42.1 R44.1 U2.E10(USB1_D_N)
USB1_D_P: R43.1 R45.1 U2.D10(USB1_D_P)
USB1_TUNE: R46.1 U2.F10(USB1_TXRTUNE)
USB1_VBUS: R40.2 U2.A11(USB1_VBUS)
USB2_TUNE: R47.1 U2.F12(USB2_TXRTUNE)
WIFI_USB_N: R44.2 ; port WIFI_USB_N
WIFI_USB_P: R45.2 ; port WIFI_USB_P
NetR41_1: R41.1 U2.AJ28(HDMI_REXT)

Not connected (* = marked no-connect by the designer): U2 A9(USB1_RX_P) A10(USB1_TX_P) A21(MIPI_CSI2_D3_P) A22(MIPI_CSI2_D2_P) A26(LVDS1_D0_P) A27(LVDS1_D1_P) A28(LVDS1_CLK_P) AH22(EARC_N_HPD) AH23(EARC_AUX) AJ23(EARC_P_UTIL) B9(USB1_RX_N) B10(USB1_TX_N) B11(USB1_DNU) B21(MIPI_CSI2_D3_N) B22(MIPI_CSI2_D2_N) B26(LVDS1_D0_N) B27(LVDS1_D1_N) B28(LVDS1_CLK_N) B29(LVDS1_D2_P) C28(LVDS1_D2_N) C29(LVDS1_D3_P) D28(LVDS1_D3_N) E12(USB2_DNU) F24(MIPI_TEST_DNU)

### Layout directives
net class BB_CON_HDMI0: (no net found under the mark)
differential pair; differential pair class DIFF100: BB_CON_CAM0_CLK_N, BB_CON_CAM0_CLK_P, BB_CON_CAM0_D0_N, BB_CON_CAM0_D0_P, BB_CON_CAM0_D1_N, BB_CON_CAM0_D1_P, BB_CON_CAM1_CLK_N, BB_CON_CAM1_CLK_P, BB_CON_CAM1_D0_N, BB_CON_CAM1_D0_P, BB_CON_CAM1_D1_N, BB_CON_CAM1_D1_P, BB_CON_CAM1_D2_N, BB_CON_CAM1_D2_P, BB_CON_CAM1_D3_N, BB_CON_CAM1_D3_P, BB_CON_HDMI0_CLK_N, BB_CON_HDMI0_CLK_P, BB_CON_HDMI0_TX0_N, BB_CON_HDMI0_TX0_P, BB_CON_HDMI0_TX1_N, BB_CON_HDMI0_TX1_P, BB_CON_HDMI0_TX2_N, BB_CON_HDMI0_TX2_P, DSI1_CLK_N, DSI1_CLK_P, DSI1_D0_N, DSI1_D0_P, DSI1_D1_N, DSI1_D1_P, DSI1_D2_N, DSI1_D2_P, DSI1_D3_N, DSI1_D3_P, LVDS0_CLK_N, LVDS0_CLK_P, LVDS0_TX0_N, LVDS0_TX0_P, LVDS0_TX1_N, LVDS0_TX1_P, LVDS0_TX2_N, LVDS0_TX2_P, LVDS0_TX3_N, LVDS0_TX3_P
net class BB_CON_USB: (no net found under the mark)
differential pair; differential pair class DIFF90: BB_CON_USB_D_N, BB_CON_USB_D_P, DBG_CON_USB_C_TX_N, DBG_CON_USB_C_TX_P, DBG_CON_USB_D_N, DBG_CON_USB_D_P, DBG_CON_USB_RX_N, DBG_CON_USB_RX_P, DBG_CON_USB_TX_N, DBG_CON_USB_TX_P, USB1_D_N, USB1_D_P
net class PCIe: (no net found under the mark)
differential pair; differential pair class DIFF85: PCIE_CLK_N, PCIE_CLK_P, PCIE_RX_N, PCIE_RX_P, PCIEC_TX_C_N, PCIEC_TX_C_P, PCIEC_TX_N, PCIEC_TX_P
net class BB_CON_CAM1: (no net found under the mark)
net class BB_CON_CAM0: (no net found under the mark)
net class DSI1: (no net found under the mark)
net class LVDS0: (no net found under the mark)
net class DBG_CON_USB: (no net found under the mark)
net class WIFI_USB: WIFI_USB_N, WIFI_USB_P

### Notes on the sheet
- i.MX 8M Plus PHYs
- HMDI
- PCIe
- Can be 1.8V or 3.3V
- USB1
- DNP
- DSI
- USB2
- LVDS
- CSI1
- CSI2
- Signal Level Indication
- Border Color = 1.8V
- Border Color = 3.3V
- Border Color = Don´t care
- OV Tech GmbH - Open Visions Technology
- (in symbol CAP_0201_10nF_25V) X7R; 0201
- (in symbol CAP_0201_100nF_10V) X5R; 0201
- (in symbol RES_0201_0R_1%) 0201
- (in symbol RES_0201_8.2k_1%) 0201
- (in symbol RES_0201_10k_1%) 0201
- (in symbol RES_0201_200R_1%) 0201
- (in symbol SoC_i.MX 8M Plus_Quad, part F) i.MX8MP - HDMI
- (in symbol SoC_i.MX 8M Plus_Quad, part G) i.MX8MP - LVDS
- (in symbol SoC_i.MX 8M Plus_Quad, part H) i.MX8MP - CSI
- (in symbol SoC_i.MX 8M Plus_Quad, part I) i.MX8MP - DSI
- (in symbol SoC_i.MX 8M Plus_Quad, part K) i.MX8MP - PCIe
- (in symbol SoC_i.MX 8M Plus_Quad, part N) i.MX8MP - USB

### Library data of the parts
?#7 = Titleblock_01_OpenSource
C110-C113 = CAP_0201_100nF_10V: Multilayer Ceramic Capacitors MLCC - SMD/SMT 0201 10VDC; Manufacturer 1: Murata Electronics; Manufacturer 1 Prt. Nr.: GRT033R61A104KE01J; Manufacturer 2 Prt. Nr.: CL03A104MP3NNNC; Manufacturer 2: Samsung Electro-Mechanics
C114 = CAP_0201_10nF_25V: Multilayer Ceramic Capacitors MLCC - SMD/SMT 0201 25VDC; Manufacturer 1: Murata Electronics; Manufacturer 1 Prt. Nr.: GRM033C81E103KE14D; Manufacturer 2 Prt. Nr.: 02013C103KAT2A; Manufacturer 2: AVX
R39 R41 = RES_0201_8.2k_1%: Thick Film Resistors - SMD 8.2K OHM 1%; Manufacturer 1: Yageo; Manufacturer 1 Prt. Nr.: RC0201FR-078K2L; Manufacturer 2 Prt. Nr.: CRCW02018K20FNED; Manufacturer 2: Vishay / Dale
R40 = RES_0201_10k_1%: Thick Film Resistors - SMD 10K OHM 1%; Manufacturer 1: Yageo; Manufacturer 1 Prt. Nr.: RC0201FR-0710KL; Manufacturer 2 Prt. Nr.: CRCW020110K0FNED; Manufacturer 2: Vishay / Dale
R42-R45 = RES_0201_0R_1%: as R31-R36 on sheet 06_8MPLUS_IO; Manufacturer 2: Vishay / Dale
R46 R47 = RES_0201_200R_1%: Thick Film Resistors - SMD 200 OHM 1%; Manufacturer 1: Yageo; Manufacturer 1 Prt. Nr.: RC0201FR-07200RL; Manufacturer 2 Prt. Nr.: CRCW0201200RFNED; Manufacturer 2: Vishay / Dale
U2 = SoC_i.MX 8M Plus_Quad: as U2 on sheet 06_8MPLUS_IO; Manufacturer 1 Prt. Nr.: MIMX8ML8CVNKZAB

## Sheet 08_DRAM_LPDDR4.SchDoc: DRAM_LPDDR4
size 420 x 297 mm; Author: Lukas Henkel; DocumentNumber: 8; SheetNumber: 8; SheetTotal: 16; DocSize: A3
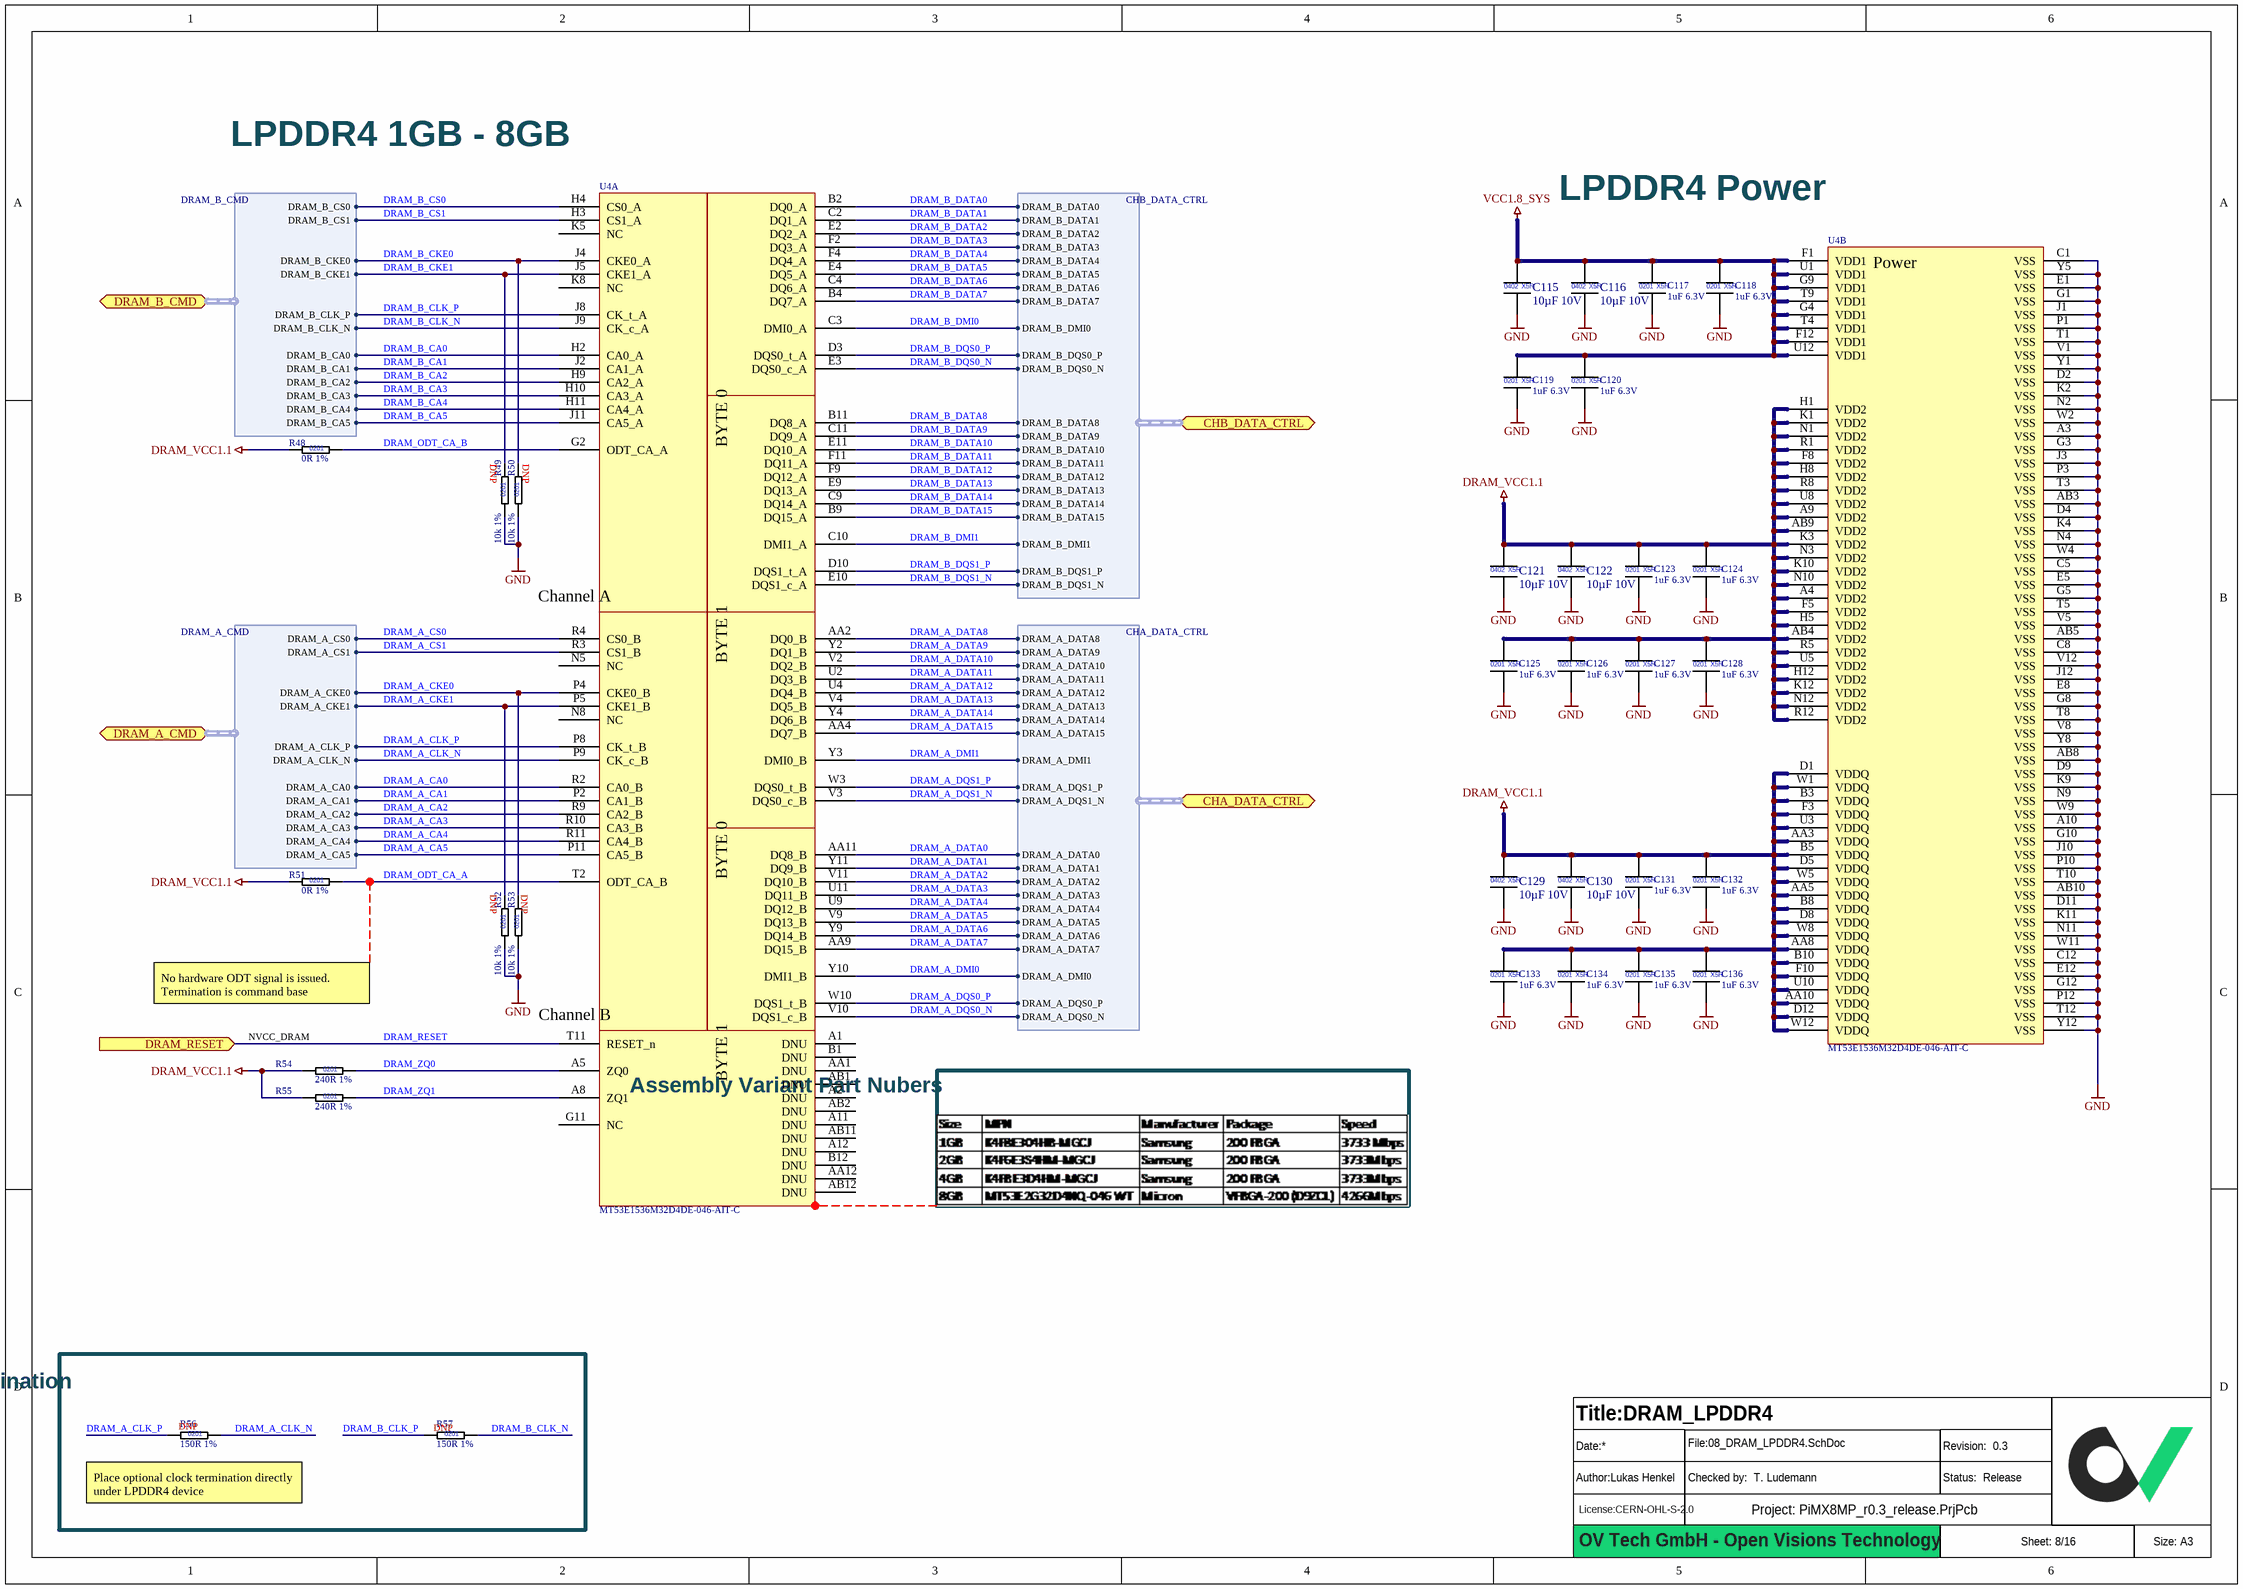
[diagram p8: 08_DRAM_LPDDR4.SchDoc]

### Parts
(Parts that share a designator on the sheet are numbered #1, #2 ... from top to bottom, then left to right.)
?#8  (no value)  (graphical)
C115  10µF 10V  [CAPC1005X06L]
C116  10µF 10V  [CAPC1005X06L]
C117  1uF 6.3V  [CAPC0603X03L]
C118  1uF 6.3V  [CAPC0603X03L]
C119  1uF 6.3V  [CAPC0603X03L]
C120  1uF 6.3V  [CAPC0603X03L]
C121  10µF 10V  [CAPC1005X06L]
C122  10µF 10V  [CAPC1005X06L]
C123  1uF 6.3V  [CAPC0603X03L]
C124  1uF 6.3V  [CAPC0603X03L]
C125  1uF 6.3V  [CAPC0603X03L]
C126  1uF 6.3V  [CAPC0603X03L]
C127  1uF 6.3V  [CAPC0603X03L]
C128  1uF 6.3V  [CAPC0603X03L]
C129  10µF 10V  [CAPC1005X06L]
C130  10µF 10V  [CAPC1005X06L]
C131  1uF 6.3V  [CAPC0603X03L]
C132  1uF 6.3V  [CAPC0603X03L]
C133  1uF 6.3V  [CAPC0603X03L]
C134  1uF 6.3V  [CAPC0603X03L]
C135  1uF 6.3V  [CAPC0603X03L]
C136  1uF 6.3V  [CAPC0603X03L]
R48  0R 1%  [RESC0603X03L]
R49  10k 1%  [RESC0603X03L]  (no BOM)
R50  10k 1%  [RESC0603X03L]  (no BOM)
R51  0R 1%  [RESC0603X03L]
R52  10k 1%  [RESC0603X03L]  (no BOM)
R53  10k 1%  [RESC0603X03L]  (no BOM)
R54  240R 1%  [RESC0603X03L]
R55  240R 1%  [RESC0603X03L]
R56  150R 1%  [RESC0603X03L]  (no BOM)
R57  150R 1%  [RESC0603X03L]  (no BOM)
U4  MT53E1536M32D4DE-046-AIT-C  [BGA200C65P12X22_1000X1450X114]  (parts A,B of 2)

### Blocks framed on the sheet
Clock Termination: R56 R57

### Ports
CHA_DATA_CTRL (bidir, harness CHA_DATA_CTRL), CHB_DATA_CTRL (bidir, harness CHB_DATA_CTRL), DRAM_A_CMD (bidir, harness DRAM_A_CMD), DRAM_B_CMD (bidir, harness DRAM_B_CMD), DRAM_RESET (in)

### Harnesses
DRAM_A_CMD: DRAM_A_CA0, DRAM_A_CA1, DRAM_A_CA2, DRAM_A_CA3, DRAM_A_CA4, DRAM_A_CA5, DRAM_A_CS0, DRAM_A_CS1, DRAM_A_CKE0, DRAM_A_CKE1, DRAM_A_CLK_P, DRAM_A_CLK_N
DRAM_B_CMD: DRAM_B_CA0, DRAM_B_CA1, DRAM_B_CA2, DRAM_B_CA3, DRAM_B_CA4, DRAM_B_CA5, DRAM_B_CS0, DRAM_B_CS1, DRAM_B_CKE0, DRAM_B_CKE1, DRAM_B_CLK_P, DRAM_B_CLK_N
CHA_DATA_CTRL: DRAM_A_DATA0, DRAM_A_DATA1, DRAM_A_DATA2, DRAM_A_DATA3, DRAM_A_DATA4, DRAM_A_DATA5, DRAM_A_DATA6, DRAM_A_DATA7, DRAM_A_DATA8, DRAM_A_DATA9, DRAM_A_DATA10, DRAM_A_DATA11, DRAM_A_DATA12, DRAM_A_DATA13, DRAM_A_DATA14, DRAM_A_DATA15, DRAM_A_DMI0, DRAM_A_DMI1, DRAM_A_DQS0_P, DRAM_A_DQS0_N, DRAM_A_DQS1_P, DRAM_A_DQS1_N
CHB_DATA_CTRL: DRAM_B_DATA0, DRAM_B_DATA1, DRAM_B_DATA2, DRAM_B_DATA3, DRAM_B_DATA4, DRAM_B_DATA5, DRAM_B_DATA6, DRAM_B_DATA7, DRAM_B_DATA8, DRAM_B_DATA9, DRAM_B_DATA10, DRAM_B_DATA11, DRAM_B_DATA12, DRAM_B_DATA13, DRAM_B_DATA14, DRAM_B_DATA15, DRAM_B_DMI0, DRAM_B_DMI1, DRAM_B_DQS0_P, DRAM_B_DQS0_N, DRAM_B_DQS1_P, DRAM_B_DQS1_N

### Nets
DRAM_VCC1.1: C121.1 C122.1 C123.1 C124.1 C125.1 C126.1 C127.1 C128.1 C129.1 C130.1 C131.1 C132.1 C133.1 C134.1 C135.1 C136.1 R48.1 R51.1 R54.1 R55.1 U4.A4(VDD2) U4.A9(VDD2) U4.AA3(VDDQ) U4.AA5(VDDQ) U4.AA8(VDDQ) U4.AA10(VDDQ) U4.AB4(VDD2) U4.AB9(VDD2) U4.B3(VDDQ) U4.B5(VDDQ) U4.B8(VDDQ) U4.B10(VDDQ) U4.D1(VDDQ) U4.D5(VDDQ) U4.D8(VDDQ) U4.D12(VDDQ) U4.F3(VDDQ) U4.F5(VDD2) U4.F8(VDD2) U4.F10(VDDQ) U4.H1(VDD2) U4.H5(VDD2) U4.H8(VDD2) U4.H12(VDD2) U4.K1(VDD2) U4.K3(VDD2) U4.K10(VDD2) U4.K12(VDD2) U4.N1(VDD2) U4.N3(VDD2) U4.N10(VDD2) U4.N12(VDD2) U4.R1(VDD2) U4.R5(VDD2) U4.R8(VDD2) U4.R12(VDD2) U4.U3(VDDQ) U4.U5(VDD2) U4.U8(VDD2) U4.U10(VDDQ) U4.W1(VDDQ) U4.W5(VDDQ) U4.W8(VDDQ) U4.W12(VDDQ)
GND: C115.2 C116.2 C117.2 C118.2 C119.2 C120.2 C121.2 C122.2 C123.2 C124.2 C125.2 C126.2 C127.2 C128.2 C129.2 C130.2 C131.2 C132.2 C133.2 C134.2 C135.2 C136.2 R49.1 R50.1 R52.1 R53.1 U4.A3(VSS) U4.A10(VSS) U4.AB3(VSS) U4.AB5(VSS) U4.AB8(VSS) U4.AB10(VSS) U4.C1(VSS) U4.C5(VSS) U4.C8(VSS) U4.C12(VSS) U4.D2(VSS) U4.D4(VSS) U4.D9(VSS) U4.D11(VSS) U4.E1(VSS) U4.E5(VSS) U4.E8(VSS) U4.E12(VSS) U4.G1(VSS) U4.G3(VSS) U4.G5(VSS) U4.G8(VSS) U4.G10(VSS) U4.G12(VSS) U4.J1(VSS) U4.J3(VSS) U4.J10(VSS) U4.J12(VSS) U4.K2(VSS) U4.K4(VSS) U4.K9(VSS) U4.K11(VSS) U4.N2(VSS) U4.N4(VSS) U4.N9(VSS) U4.N11(VSS) U4.P1(VSS) U4.P3(VSS) U4.P10(VSS) U4.P12(VSS) U4.T1(VSS) U4.T3(VSS) U4.T5(VSS) U4.T8(VSS) U4.T10(VSS) U4.T12(VSS) U4.V1(VSS) U4.V5(VSS) U4.V8(VSS) U4.V12(VSS) U4.W2(VSS) U4.W4(VSS) U4.W9(VSS) U4.W11(VSS) U4.Y1(VSS) U4.Y5(VSS) U4.Y8(VSS) U4.Y12(VSS)
VCC1.8_SYS: C115.1 C116.1 C117.1 C118.1 C119.1 C120.1 U4.F1(VDD1) U4.F12(VDD1) U4.G4(VDD1) U4.G9(VDD1) U4.T4(VDD1) U4.T9(VDD1) U4.U1(VDD1) U4.U12(VDD1)
DRAM_A_CA0: U4.R2(CA0_B) ; port DRAM_A_CMD.DRAM_A_CA0
DRAM_A_CA1: U4.P2(CA1_B) ; port DRAM_A_CMD.DRAM_A_CA1
DRAM_A_CA2: U4.R9(CA2_B) ; port DRAM_A_CMD.DRAM_A_CA2
DRAM_A_CA3: U4.R10(CA3_B) ; port DRAM_A_CMD.DRAM_A_CA3
DRAM_A_CA4: U4.R11(CA4_B) ; port DRAM_A_CMD.DRAM_A_CA4
DRAM_A_CA5: U4.P11(CA5_B) ; port DRAM_A_CMD.DRAM_A_CA5
DRAM_A_CKE0: R53.2 U4.P4(CKE0_B) ; port DRAM_A_CMD.DRAM_A_CKE0
DRAM_A_CKE1: R52.2 U4.P5(CKE1_B) ; port DRAM_A_CMD.DRAM_A_CKE1
DRAM_A_CLK_N: R56.2 U4.P9(CK_c_B) ; port DRAM_A_CMD.DRAM_A_CLK_N
DRAM_A_CLK_P: R56.1 U4.P8(CK_t_B) ; port DRAM_A_CMD.DRAM_A_CLK_P
DRAM_A_CS0: U4.R4(CS0_B) ; port DRAM_A_CMD.DRAM_A_CS0
DRAM_A_CS1: U4.R3(CS1_B) ; port DRAM_A_CMD.DRAM_A_CS1
DRAM_A_DATA0: U4.AA11(DQ8_B) ; port CHA_DATA_CTRL.DRAM_A_DATA0
DRAM_A_DATA1: U4.Y11(DQ9_B) ; port CHA_DATA_CTRL.DRAM_A_DATA1
DRAM_A_DATA2: U4.V11(DQ10_B) ; port CHA_DATA_CTRL.DRAM_A_DATA2
DRAM_A_DATA3: U4.U11(DQ11_B) ; port CHA_DATA_CTRL.DRAM_A_DATA3
DRAM_A_DATA4: U4.U9(DQ12_B) ; port CHA_DATA_CTRL.DRAM_A_DATA4
DRAM_A_DATA5: U4.V9(DQ13_B) ; port CHA_DATA_CTRL.DRAM_A_DATA5
DRAM_A_DATA6: U4.Y9(DQ14_B) ; port CHA_DATA_CTRL.DRAM_A_DATA6
DRAM_A_DATA7: U4.AA9(DQ15_B) ; port CHA_DATA_CTRL.DRAM_A_DATA7
DRAM_A_DATA8: U4.AA2(DQ0_B) ; port CHA_DATA_CTRL.DRAM_A_DATA8
DRAM_A_DATA9: U4.Y2(DQ1_B) ; port CHA_DATA_CTRL.DRAM_A_DATA9
DRAM_A_DATA10: U4.V2(DQ2_B) ; port CHA_DATA_CTRL.DRAM_A_DATA10
DRAM_A_DATA11: U4.U2(DQ3_B) ; port CHA_DATA_CTRL.DRAM_A_DATA11
DRAM_A_DATA12: U4.U4(DQ4_B) ; port CHA_DATA_CTRL.DRAM_A_DATA12
DRAM_A_DATA13: U4.V4(DQ5_B) ; port CHA_DATA_CTRL.DRAM_A_DATA13
DRAM_A_DATA14: U4.Y4(DQ6_B) ; port CHA_DATA_CTRL.DRAM_A_DATA14
DRAM_A_DATA15: U4.AA4(DQ7_B) ; port CHA_DATA_CTRL.DRAM_A_DATA15
DRAM_A_DMI0: U4.Y10(DMI1_B) ; port CHA_DATA_CTRL.DRAM_A_DMI0
DRAM_A_DMI1: U4.Y3(DMI0_B) ; port CHA_DATA_CTRL.DRAM_A_DMI1
DRAM_A_DQS0_N: U4.V10(DQS1_c_B) ; port CHA_DATA_CTRL.DRAM_A_DQS0_N
DRAM_A_DQS0_P: U4.W10(DQS1_t_B) ; port CHA_DATA_CTRL.DRAM_A_DQS0_P
DRAM_A_DQS1_N: U4.V3(DQS0_c_B) ; port CHA_DATA_CTRL.DRAM_A_DQS1_N
DRAM_A_DQS1_P: U4.W3(DQS0_t_B) ; port CHA_DATA_CTRL.DRAM_A_DQS1_P
DRAM_B_CA0: U4.H2(CA0_A) ; port DRAM_B_CMD.DRAM_B_CA0
DRAM_B_CA1: U4.J2(CA1_A) ; port DRAM_B_CMD.DRAM_B_CA1
DRAM_B_CA2: U4.H9(CA2_A) ; port DRAM_B_CMD.DRAM_B_CA2
DRAM_B_CA3: U4.H10(CA3_A) ; port DRAM_B_CMD.DRAM_B_CA3
DRAM_B_CA4: U4.H11(CA4_A) ; port DRAM_B_CMD.DRAM_B_CA4
DRAM_B_CA5: U4.J11(CA5_A) ; port DRAM_B_CMD.DRAM_B_CA5
DRAM_B_CKE0: R50.2 U4.J4(CKE0_A) ; port DRAM_B_CMD.DRAM_B_CKE0
DRAM_B_CKE1: R49.2 U4.J5(CKE1_A) ; port DRAM_B_CMD.DRAM_B_CKE1
DRAM_B_CLK_N: R57.2 U4.J9(CK_c_A) ; port DRAM_B_CMD.DRAM_B_CLK_N
DRAM_B_CLK_P: R57.1 U4.J8(CK_t_A) ; port DRAM_B_CMD.DRAM_B_CLK_P
DRAM_B_CS0: U4.H4(CS0_A) ; port DRAM_B_CMD.DRAM_B_CS0
DRAM_B_CS1: U4.H3(CS1_A) ; port DRAM_B_CMD.DRAM_B_CS1
DRAM_B_DATA0: U4.B2(DQ0_A) ; port CHB_DATA_CTRL.DRAM_B_DATA0
DRAM_B_DATA1: U4.C2(DQ1_A) ; port CHB_DATA_CTRL.DRAM_B_DATA1
DRAM_B_DATA2: U4.E2(DQ2_A) ; port CHB_DATA_CTRL.DRAM_B_DATA2
DRAM_B_DATA3: U4.F2(DQ3_A) ; port CHB_DATA_CTRL.DRAM_B_DATA3
DRAM_B_DATA4: U4.F4(DQ4_A) ; port CHB_DATA_CTRL.DRAM_B_DATA4
DRAM_B_DATA5: U4.E4(DQ5_A) ; port CHB_DATA_CTRL.DRAM_B_DATA5
DRAM_B_DATA6: U4.C4(DQ6_A) ; port CHB_DATA_CTRL.DRAM_B_DATA6
DRAM_B_DATA7: U4.B4(DQ7_A) ; port CHB_DATA_CTRL.DRAM_B_DATA7
DRAM_B_DATA8: U4.B11(DQ8_A) ; port CHB_DATA_CTRL.DRAM_B_DATA8
DRAM_B_DATA9: U4.C11(DQ9_A) ; port CHB_DATA_CTRL.DRAM_B_DATA9
DRAM_B_DATA10: U4.E11(DQ10_A) ; port CHB_DATA_CTRL.DRAM_B_DATA10
DRAM_B_DATA11: U4.F11(DQ11_A) ; port CHB_DATA_CTRL.DRAM_B_DATA11
DRAM_B_DATA12: U4.F9(DQ12_A) ; port CHB_DATA_CTRL.DRAM_B_DATA12
DRAM_B_DATA13: U4.E9(DQ13_A) ; port CHB_DATA_CTRL.DRAM_B_DATA13
DRAM_B_DATA14: U4.C9(DQ14_A) ; port CHB_DATA_CTRL.DRAM_B_DATA14
DRAM_B_DATA15: U4.B9(DQ15_A) ; port CHB_DATA_CTRL.DRAM_B_DATA15
DRAM_B_DMI0: U4.C3(DMI0_A) ; port CHB_DATA_CTRL.DRAM_B_DMI0
DRAM_B_DMI1: U4.C10(DMI1_A) ; port CHB_DATA_CTRL.DRAM_B_DMI1
DRAM_B_DQS0_N: U4.E3(DQS0_c_A) ; port CHB_DATA_CTRL.DRAM_B_DQS0_N
DRAM_B_DQS0_P: U4.D3(DQS0_t_A) ; port CHB_DATA_CTRL.DRAM_B_DQS0_P
DRAM_B_DQS1_N: U4.E10(DQS1_c_A) ; port CHB_DATA_CTRL.DRAM_B_DQS1_N
DRAM_B_DQS1_P: U4.D10(DQS1_t_A) ; port CHB_DATA_CTRL.DRAM_B_DQS1_P
DRAM_ODT_CA_A: R51.2 U4.T2(ODT_CA_B)
DRAM_ODT_CA_B: R48.2 U4.G2(ODT_CA_A)
DRAM_RESET: U4.T11(RESET_n) ; port DRAM_RESET
DRAM_ZQ0: R54.2 U4.A5(ZQ0)
DRAM_ZQ1: R55.2 U4.A8(ZQ1)

Not connected (* = marked no-connect by the designer): U4 A1(DNU) A2(DNU) A11(DNU) A12(DNU) AA1(DNU) AA12(DNU) AB1(DNU) AB2(DNU) AB11(DNU) AB12(DNU) B1(DNU) B12(DNU) G11(NC) K5(NC) K8(NC) N5(NC) N8(NC)

### Notes on the sheet
- LPDDR4 1GB - 8GB
- LPDDR4 Power
- (near R49) DNP
- (near R50) DNP
- (near R52) DNP
- (near R53) DNP
- No hardware ODT signal is issued. Termination is command base
- (near R54) NVCC_DRAM
- Assembly Variant Part Nubers
- (near R56) DNP
- (near R57) DNP
- (near R56) Place optional clock termination directly under LPDDR4 device
- OV Tech GmbH - Open Visions Technology
- (in symbol CAP_0201_1uF_6.3V) 0201; X5R
- (in symbol CAP_0402_10µ_10V) 0402; X5R
- (in symbol LPDDR4_MT53E1536M32D4DE-046-AIT-C, part A) BYTE 0; Channel A; BYTE 1; Channel B
- (in symbol LPDDR4_MT53E1536M32D4DE-046-AIT-C, part B) Power
- (in symbol RES_0201_0R_1%) 0201
- (in symbol RES_0201_10k_1%) 0201
- (in symbol RES_0201_150R_1%) 0201
- (in symbol RES_0201_240R_1%) 0201

### Library data of the parts
?#8 = Titleblock_01_OpenSource
C115 C116 C121 C122 C129 C130 = CAP_0402_10µ_10V: Multilayer Ceramic Capacitors MLCC - SMD/SMT 0402 10VDC; Manufacturer 1: Murata Electronics; Manufacturer 1 Prt. Nr.: GRM155R61A106ME11D; Manufacturer 2 Prt. Nr.: 0402ZD106MAT4A; Manufacturer 2: KYOCERA AVX
C117-C120 C123-C128 C131-C136 = CAP_0201_1uF_6.3V: as C107 on sheet 06_8MPLUS_IO; Manufacturer 2: Samsung Electro-Mechanics
R48 R51 = RES_0201_0R_1%: as R31-R36 on sheet 06_8MPLUS_IO; Manufacturer 2: Vishay / Dale
R49 R50 R52 R53 = RES_0201_10k_1%: as R40 on sheet 07_8MPLUS_PHY; Manufacturer 2: Vishay / Dale
R54 R55 = RES_0201_240R_1%: Thick Film Resistors - SMD 240 OHM 1%; Manufacturer 1: Yageo; Manufacturer 1 Prt. Nr.: RC0201FR-07240RL; Manufacturer 2 Prt. Nr.: CRCW0201240RFNED; Manufacturer 2: Vishay / Dale
R56 R57 = RES_0201_150R_1%: Thick Film Resistors - SMD 150 OHM 1%; Manufacturer 1: Yageo; Manufacturer 1 Prt. Nr.: RC0201FR-07150RL; Manufacturer 2 Prt. Nr.: CRCW0201150RFNED; Manufacturer 2: Vishay / Dale
U4 = LPDDR4_MT53E1536M32D4DE-046-AIT-C: DRAM LPDDR4 48G 1.5GX32 FBGA QDP; Manufacturer 1: Micron; Manufacturer 1 Prt. Nr.: MT53E1536M32D4DE-046-AIT-C

## Sheet 09_eMMC_Flash.SchDoc: eMMC_Flash
size 420 x 297 mm; Author: Lukas Henkel; DocumentNumber: 9; SheetNumber: 9; SheetTotal: 16; DocSize: A3
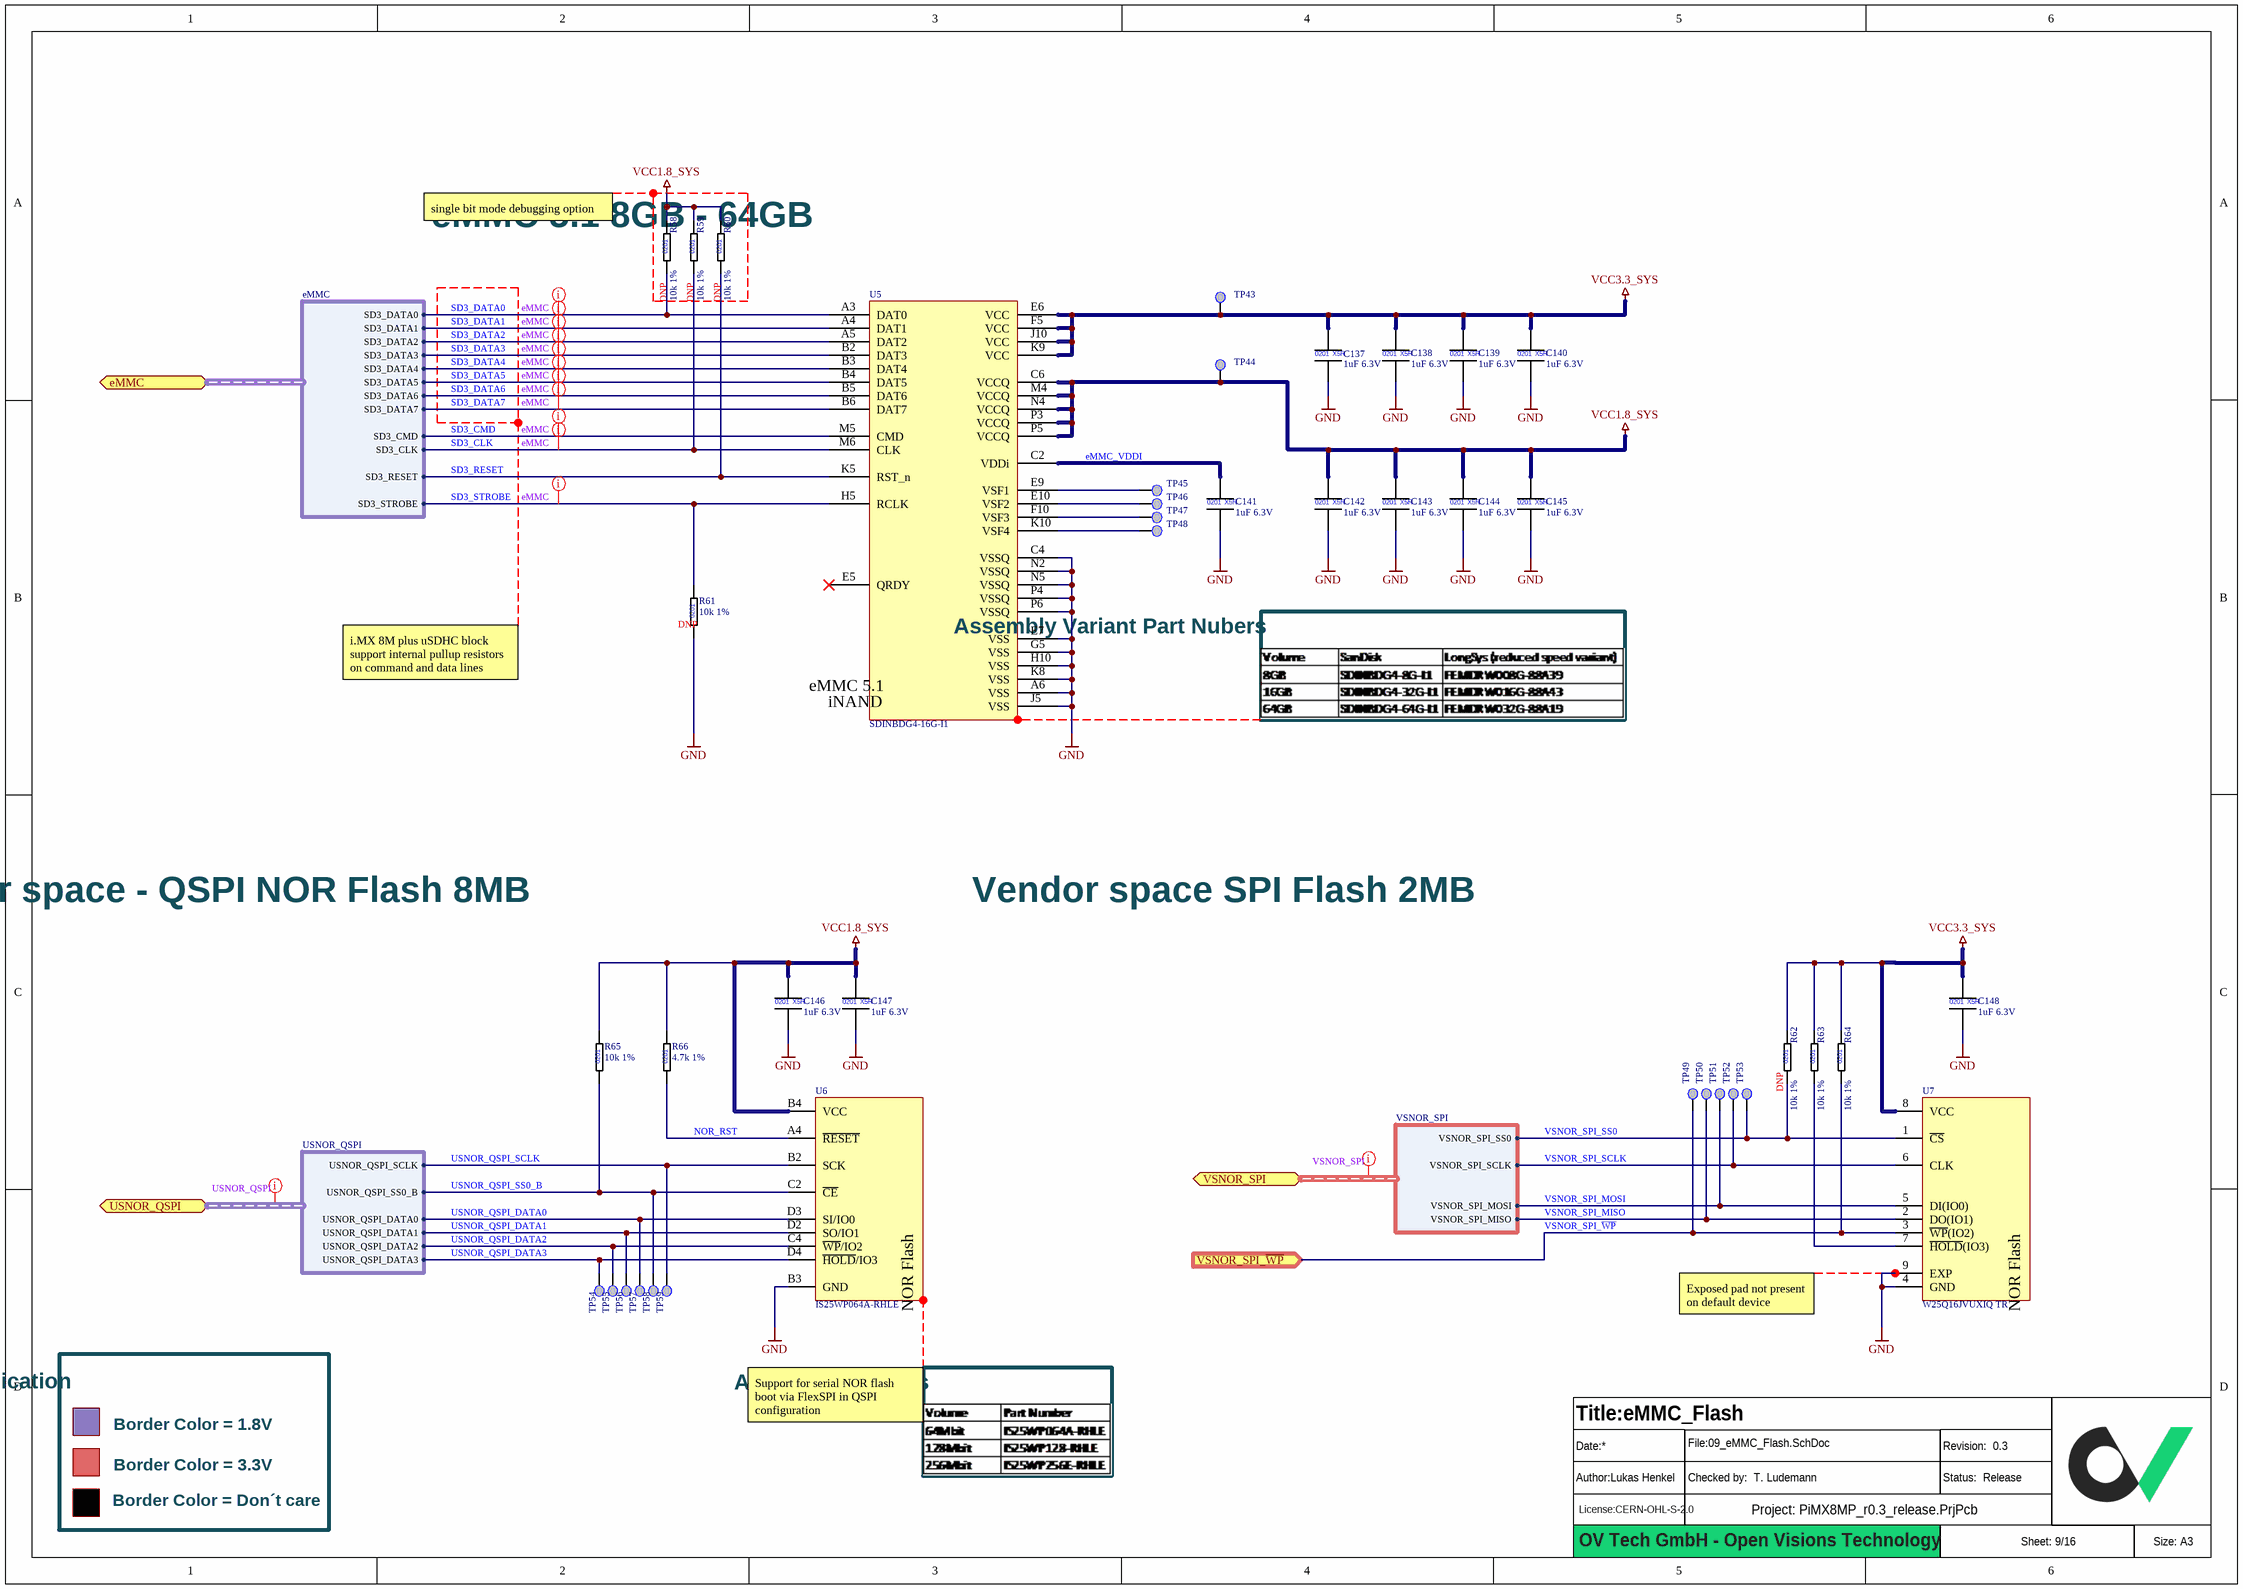
[diagram p9: 09_eMMC_Flash.SchDoc]

### Parts
(Parts that share a designator on the sheet are numbered #1, #2 ... from top to bottom, then left to right.)
?#9  (no value)  (graphical)
C137  1uF 6.3V  [CAPC0603X03L]
C138  1uF 6.3V  [CAPC0603X03L]
C139  1uF 6.3V  [CAPC0603X03L]
C140  1uF 6.3V  [CAPC0603X03L]
C141  1uF 6.3V  [CAPC0603X03L]
C142  1uF 6.3V  [CAPC0603X03L]
C143  1uF 6.3V  [CAPC0603X03L]
C144  1uF 6.3V  [CAPC0603X03L]
C145  1uF 6.3V  [CAPC0603X03L]
C146  1uF 6.3V  [CAPC0603X03L]
C147  1uF 6.3V  [CAPC0603X03L]
C148  1uF 6.3V  [CAPC0603X03L]
R58  10k 1%  [RESC0603X03L]  (no BOM)
R59  10k 1%  [RESC0603X03L]  (no BOM)
R60  10k 1%  [RESC0603X03L]
R61  10k 1%  [RESC0603X03L]  (no BOM)
R62  10k 1%  [RESC0603X03L]
R63  10k 1%  [RESC0603X03L]
R64  10k 1%  [RESC0603X03L]
R65  10k 1%  [RESC0603X03L]
R66  4.7k 1%  [RESC0603X03L]
TP43  Testpoint 0.5mm  [TP_0.50mm]  (value not drawn)  (no BOM)
TP44  Testpoint 0.5mm  [TP_0.50mm]  (value not drawn)  (no BOM)
TP45  Testpoint 0.5mm  [TP_0.50mm]  (value not drawn)  (no BOM)
TP46  Testpoint 0.5mm  [TP_0.50mm]  (value not drawn)  (no BOM)
TP47  Testpoint 0.5mm  [TP_0.50mm]  (value not drawn)  (no BOM)
TP48  Testpoint 0.5mm  [TP_0.50mm]  (value not drawn)  (no BOM)
TP49  Testpoint 0.5mm  [TP_0.50mm]  (value not drawn)  (no BOM)
TP50  Testpoint 0.5mm  [TP_0.50mm]  (value not drawn)  (no BOM)
TP51  Testpoint 0.5mm  [TP_0.50mm]  (value not drawn)  (no BOM)
TP52  Testpoint 0.5mm  [TP_0.50mm]  (value not drawn)  (no BOM)
TP53  Testpoint 0.5mm  [TP_0.50mm]  (value not drawn)  (no BOM)
TP54  Testpoint 0.5mm  [TP_0.50mm]  (value not drawn)  (no BOM)
TP55  Testpoint 0.5mm  [TP_0.50mm]  (value not drawn)  (no BOM)
TP56  Testpoint 0.5mm  [TP_0.50mm]  (value not drawn)  (no BOM)
TP57  Testpoint 0.5mm  [TP_0.50mm]  (value not drawn)  (no BOM)
TP58  Testpoint 0.5mm  [TP_0.50mm]  (value not drawn)  (no BOM)
TP59  Testpoint 0.5mm  [TP_0.50mm]  (value not drawn)  (no BOM)
U5  SDINBDG4-16G-I1  [BGA153C50P14X14_1150X1300X80]
U6  IS25WP064A-RHLE  [BGA24C100P5X5_600X800X120]
U7  W25Q16JVUXIQ TR  [QFN50P300X200X60_HS-9L]

### Ports
eMMC (bidir, harness eMMC), USNOR_QSPI (bidir, harness USNOR_QSPI), VSNOR_SPI (bidir, harness VSNOR_SPI), VSNOR_SPI_~{WP} (in)

### Harnesses
eMMC: SD3_STROBE, SD3_CLK, SD3_CMD, SD3_DATA0, SD3_DATA1, SD3_DATA2, SD3_DATA3, SD3_DATA4, SD3_DATA5, SD3_DATA6, SD3_DATA7, SD3_RESET
USNOR_QSPI: USNOR_QSPI_SCLK, USNOR_QSPI_SS0_B, USNOR_QSPI_DATA0, USNOR_QSPI_DATA1, USNOR_QSPI_DATA2, USNOR_QSPI_DATA3
VSNOR_SPI: VSNOR_SPI_SS0, VSNOR_SPI_SCLK, VSNOR_SPI_MOSI, VSNOR_SPI_MISO

### Nets
GND: C137.2 C138.2 C139.2 C140.2 C141.2 C142.2 C143.2 C144.2 C145.2 C146.2 C147.2 C148.2 R61.1 U5.A6(VSS) U5.C4(VSSQ) U5.E7(VSS) U5.G5(VSS) U5.H10(VSS) U5.J5(VSS) U5.K8(VSS) U5.N2(VSSQ) U5.N5(VSSQ) U5.P4(VSSQ) U5.P6(VSSQ) U6.B3(GND) U7.4(GND) U7.9(EXP)
VCC1.8_SYS: C142.1 C143.1 C144.1 C145.1 C146.1 C147.1 R58.2 R59.2 R60.2 R65.2 R66.2 TP44.TP U5.C6(VCCQ) U5.M4(VCCQ) U5.N4(VCCQ) U5.P3(VCCQ) U5.P5(VCCQ) U6.B4(VCC)
VCC3.3_SYS: C137.1 C138.1 C139.1 C140.1 C148.1 R62.2 R63.2 R64.2 TP43.TP U5.E6(VCC) U5.F5(VCC) U5.J10(VCC) U5.K9(VCC) U7.8(VCC)
eMMC_VDDI: C141.1 U5.C2(VDDi)
NOR_RST: R66.1 U6.A4(~{RESET})
SD3_CLK: R59.1 U5.M6(CLK) ; port eMMC.SD3_CLK
SD3_CMD: U5.M5(CMD) ; port eMMC.SD3_CMD
SD3_DATA0: R58.1 U5.A3(DAT0) ; port eMMC.SD3_DATA0
SD3_DATA1: U5.A4(DAT1) ; port eMMC.SD3_DATA1
SD3_DATA2: U5.A5(DAT2) ; port eMMC.SD3_DATA2
SD3_DATA3: U5.B2(DAT3) ; port eMMC.SD3_DATA3
SD3_DATA4: U5.B3(DAT4) ; port eMMC.SD3_DATA4
SD3_DATA5: U5.B4(DAT5) ; port eMMC.SD3_DATA5
SD3_DATA6: U5.B5(DAT6) ; port eMMC.SD3_DATA6
SD3_DATA7: U5.B6(DAT7) ; port eMMC.SD3_DATA7
SD3_RESET: R60.1 U5.K5(RST_n) ; port eMMC.SD3_RESET
SD3_STROBE: R61.2 U5.H5(RCLK) ; port eMMC.SD3_STROBE
USNOR_QSPI_DATA0: TP57.TP U6.D3(SI/IO0) ; port USNOR_QSPI.USNOR_QSPI_DATA0
USNOR_QSPI_DATA1: TP56.TP U6.D2(SO/IO1) ; port USNOR_QSPI.USNOR_QSPI_DATA1
USNOR_QSPI_DATA2: TP55.TP U6.C4(~{WP}/IO2) ; port USNOR_QSPI.USNOR_QSPI_DATA2
USNOR_QSPI_DATA3: TP54.TP U6.D4(~{HOLD}/IO3) ; port USNOR_QSPI.USNOR_QSPI_DATA3
USNOR_QSPI_SCLK: TP59.TP U6.B2(SCK) ; port USNOR_QSPI.USNOR_QSPI_SCLK
USNOR_QSPI_SS0_B: R65.1 TP58.TP U6.C2(~{CE}) ; port USNOR_QSPI.USNOR_QSPI_SS0_B
VSNOR_SPI_MISO: TP50.TP U7.2(DO(IO1)) ; port VSNOR_SPI.VSNOR_SPI_MISO
VSNOR_SPI_MOSI: TP51.TP U7.5(DI(IO0)) ; port VSNOR_SPI.VSNOR_SPI_MOSI
VSNOR_SPI_SCLK: TP52.TP U7.6(CLK) ; port VSNOR_SPI.VSNOR_SPI_SCLK
VSNOR_SPI_SS0: R62.1 TP53.TP U7.1(~{CS}) ; port VSNOR_SPI.VSNOR_SPI_SS0
VSNOR_SPI_~{WP}: R64.1 TP49.TP U7.3(~{WP}(IO2)) ; port VSNOR_SPI_~{WP}
NetR63_1: R63.1 U7.7(~{HOLD}(IO3))
NetTP45_TP: TP45.TP U5.E9(VSF1)
NetTP46_TP: TP46.TP U5.E10(VSF2)
NetTP47_TP: TP47.TP U5.F10(VSF3)
NetTP48_TP: TP48.TP U5.K10(VSF4)

Not connected (* = marked no-connect by the designer): U5 E5(QRDY)*

### Layout directives
net class eMMC: SD3_CLK, SD3_CMD, SD3_DATA0, SD3_DATA1, SD3_DATA2, SD3_DATA3, SD3_DATA4, SD3_DATA5, SD3_DATA6, SD3_DATA7, SD3_STROBE
net class USNOR_QSPI: (no net found under the mark)
net class VSNOR_SPI: (no net found under the mark)

### Notes on the sheet
- eMMC 5.1 8GB - 64GB
- single bit mode debugging option
- (near R58) DNP
- (near R59) DNP
- (near R60) DNP
- (near R61) DNP
- Assembly Variant Part Nubers
- i.MX 8M plus uSDHC block support internal pullup resistors on command and data lines
- User space - QSPI NOR Flash 8MB
- Vendor space SPI Flash 2MB
- (near R62) DNP
- Exposed pad not present on default device
- Signal Level Indication
- Assembly Variants
- Border Color = 1.8V
- Border Color = 3.3V
- Support for serial NOR flash boot via FlexSPI in QSPI configuration
- Border Color = Don´t care
- OV Tech GmbH - Open Visions Technology
- (in symbol CAP_0201_1uF_6.3V) 0201; X5R
- (in symbol eMMC_SDINBDG4-16G-I1) eMMC 5.1; iNAND
- (in symbol NOR_Flash_IS25WP064A-RHLE) NOR Flash
- (in symbol NOR_Flash_W25Q16) NOR Flash
- (in symbol RES_0201_4.7k_1%) 0201
- (in symbol RES_0201_10k_1%) 0201

### Library data of the parts
?#9 = Titleblock_01_OpenSource
C137-C148 = CAP_0201_1uF_6.3V: as C107 on sheet 06_8MPLUS_IO; Manufacturer 2: Samsung Electro-Mechanics
R58-R65 = RES_0201_10k_1%: as R40 on sheet 07_8MPLUS_PHY; Manufacturer 2: Vishay / Dale
R66 = RES_0201_4.7k_1%: as R37 on sheet 06_8MPLUS_IO; Manufacturer 2: Vishay / Dale
U5 = eMMC_SDINBDG4-16G-I1: iNAND eMMC 16GB; Manufacturer 1: SanDisk; Manufacturer 1 Prt. Nr.: SDINBDG4-16G-I1
U6 = NOR_Flash_IS25WP064A-RHLE: NOR Flash 64Mbit; Manufacturer 1: ISSI; Manufacturer 1 Prt. Nr.: IS25WP064A-RHLE
U7 = NOR_Flash_W25Q16: NOR Flash spiFlash, 3V, 16M-bit, 4Kb Uniform Sector, DTR; Manufacturer 1: Winbond; Manufacturer 1 Prt. Nr.: W25Q16JVUXIQ TR; Temperature Range: -40°C - 85°C